# EAGLE design headstage-neuropix_no-test-fixtures (EAGLE 8.3.2)
DESIGNER: JON NEWMAN; DESIGN_NAME: HEADSTAGE-NEUROPIX; LICENSE: CERN OHL v1.2; REVISION: 1.2
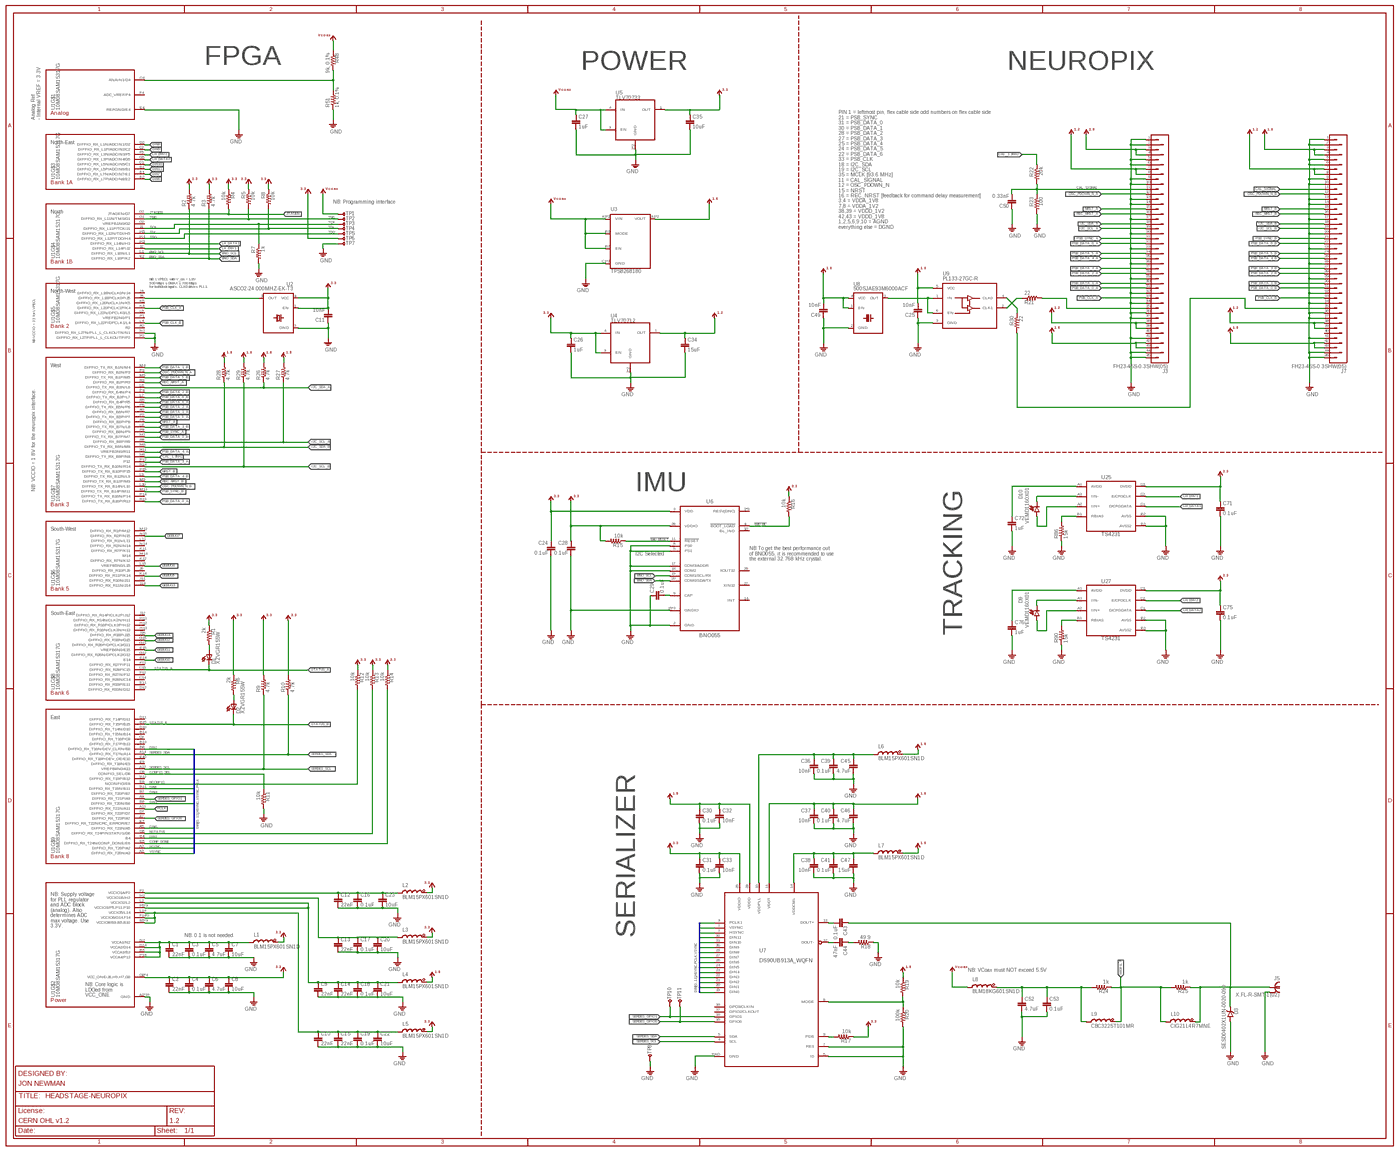
[diagram p0: schematic, sheet 1, overview]
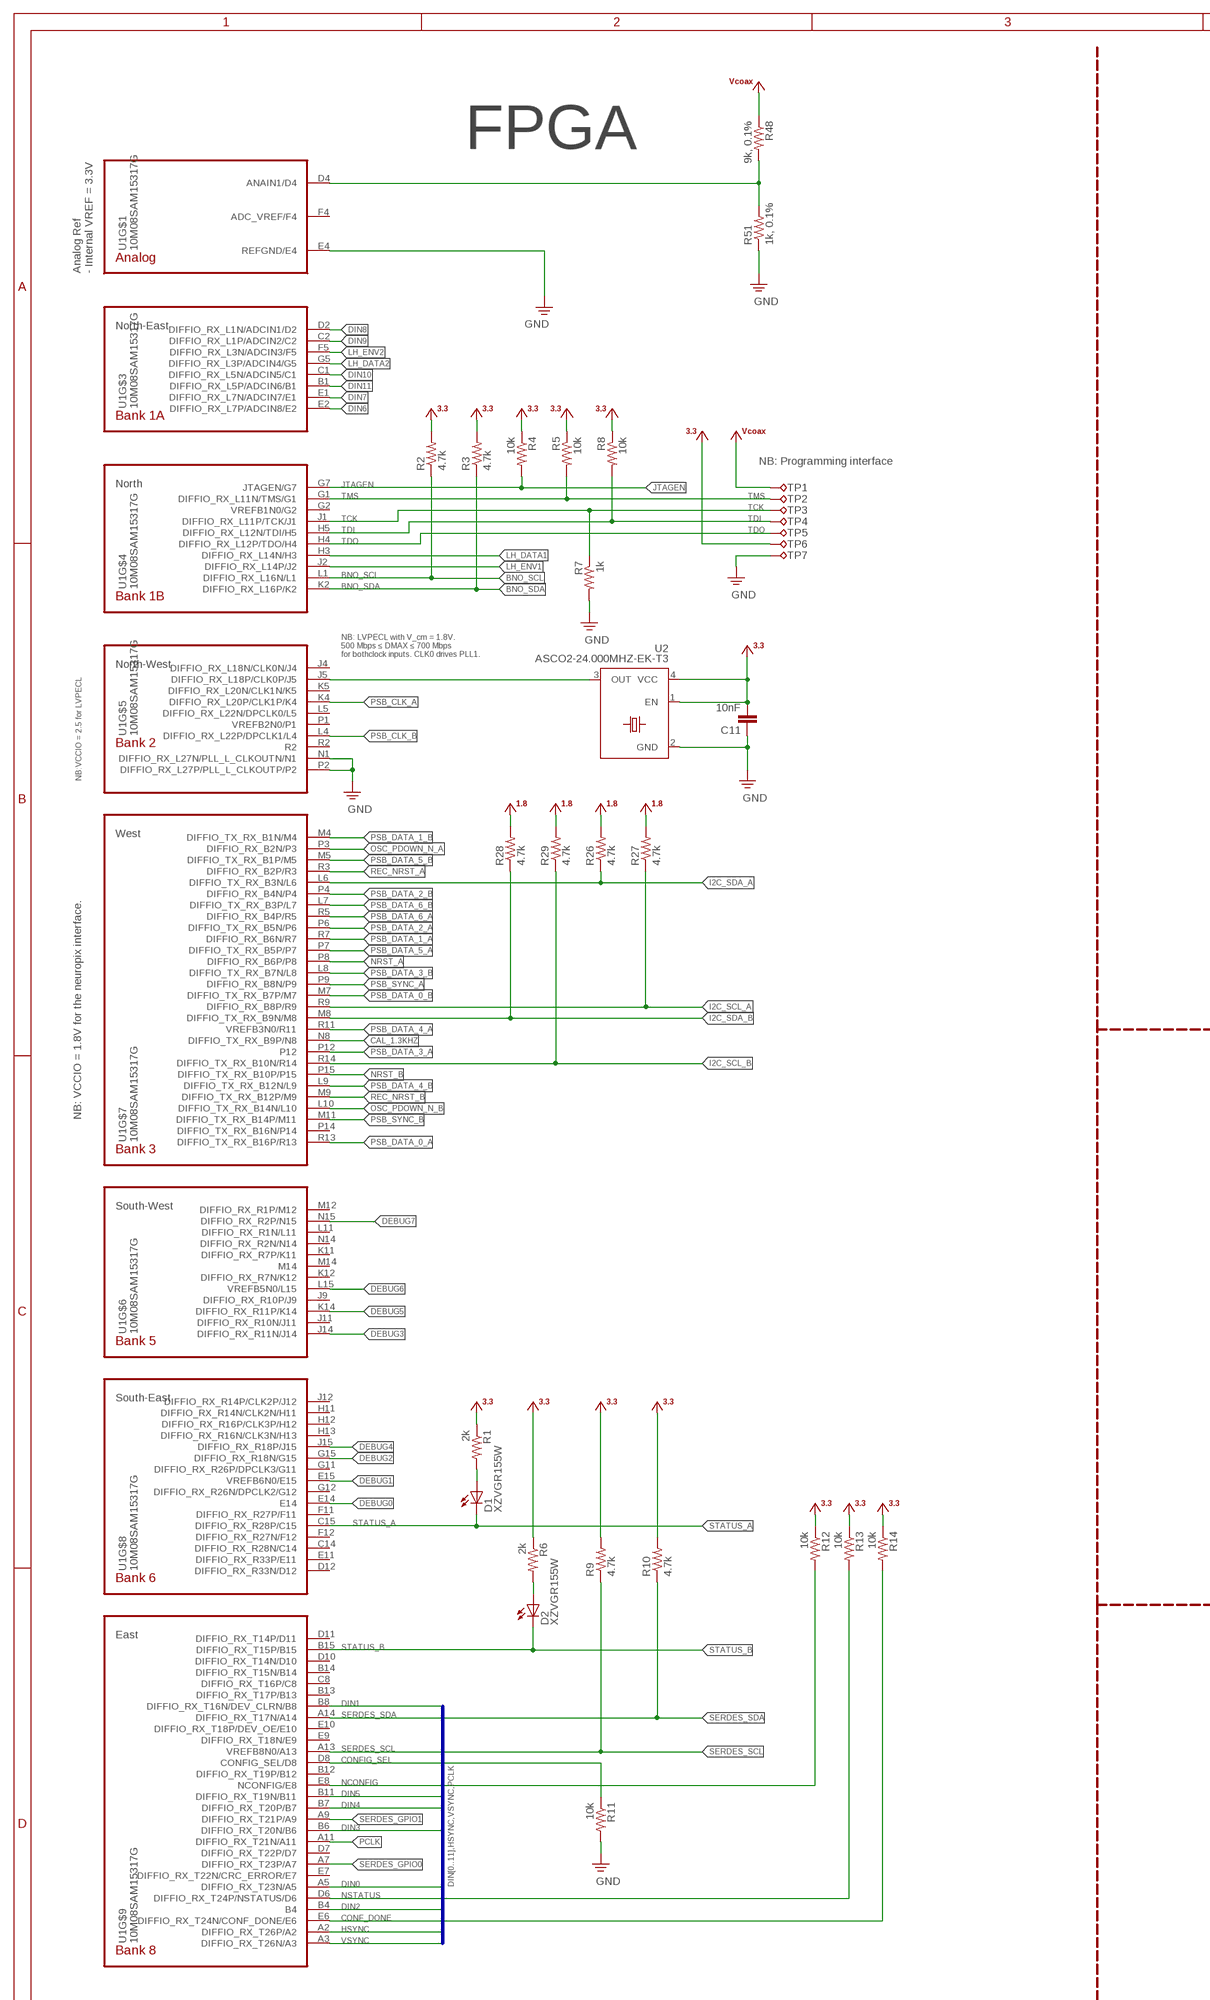
[diagram p1: schematic, sheet 1, part 1 of 4]
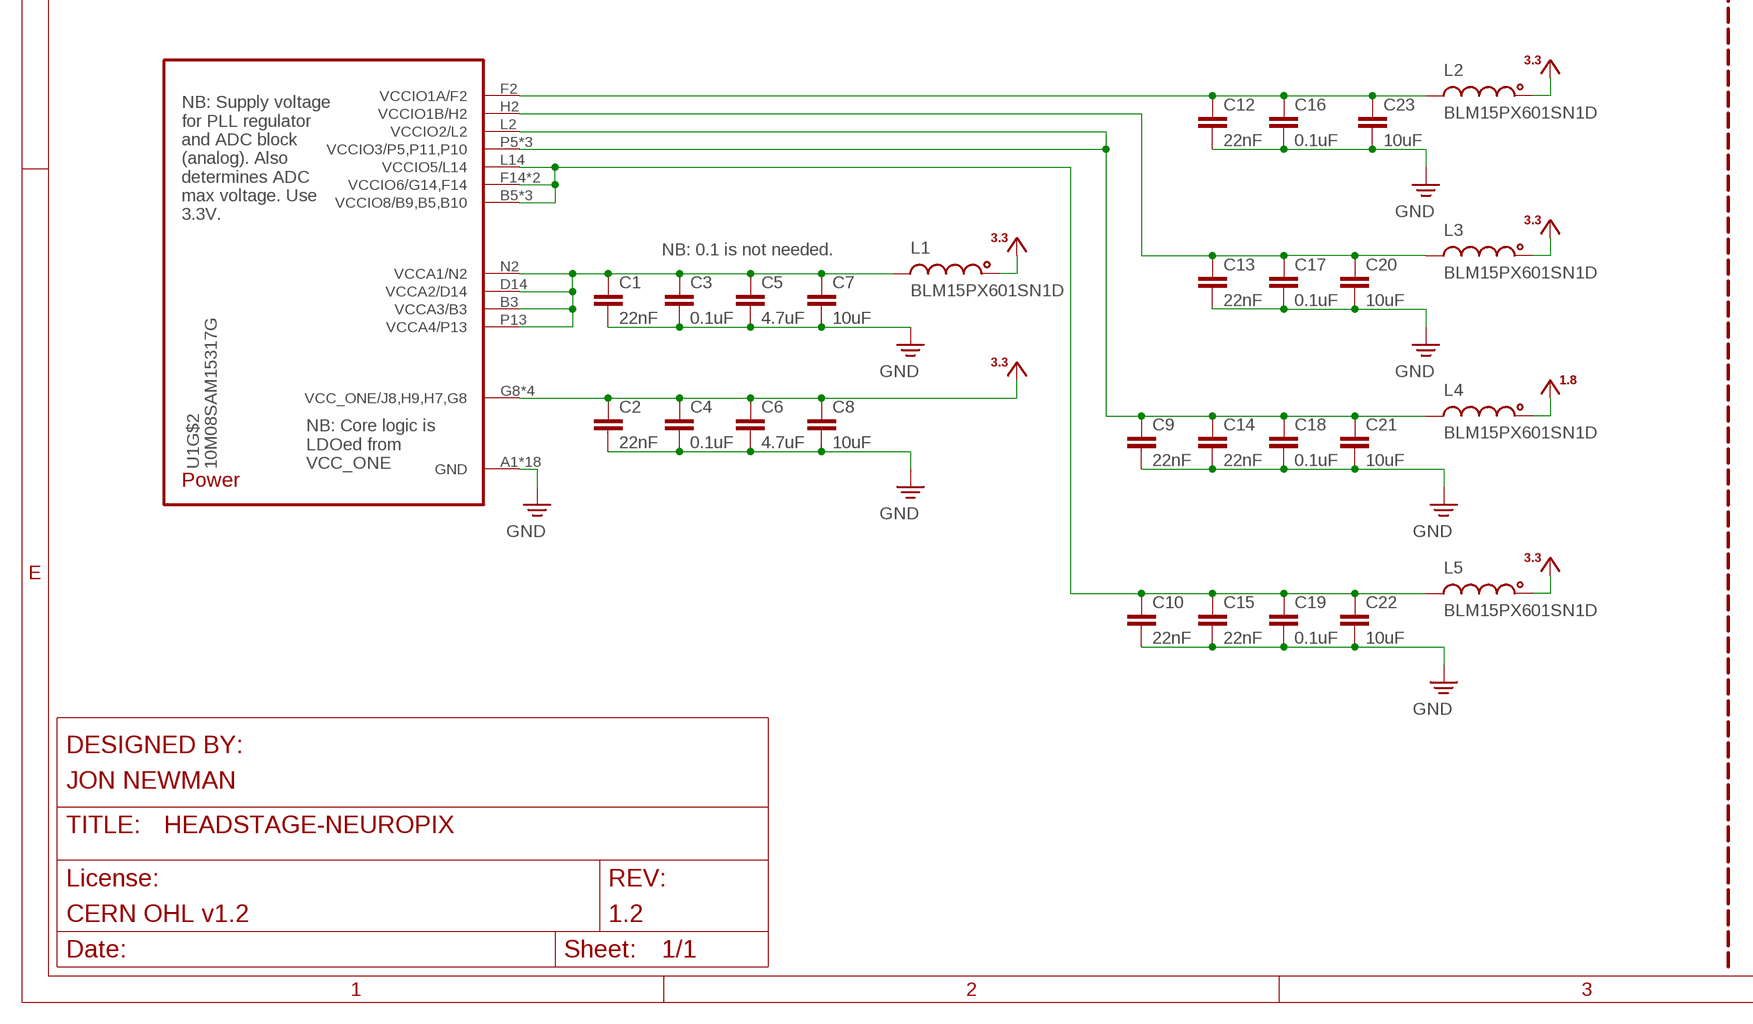
[diagram p2: schematic, sheet 1, part 2 of 4]
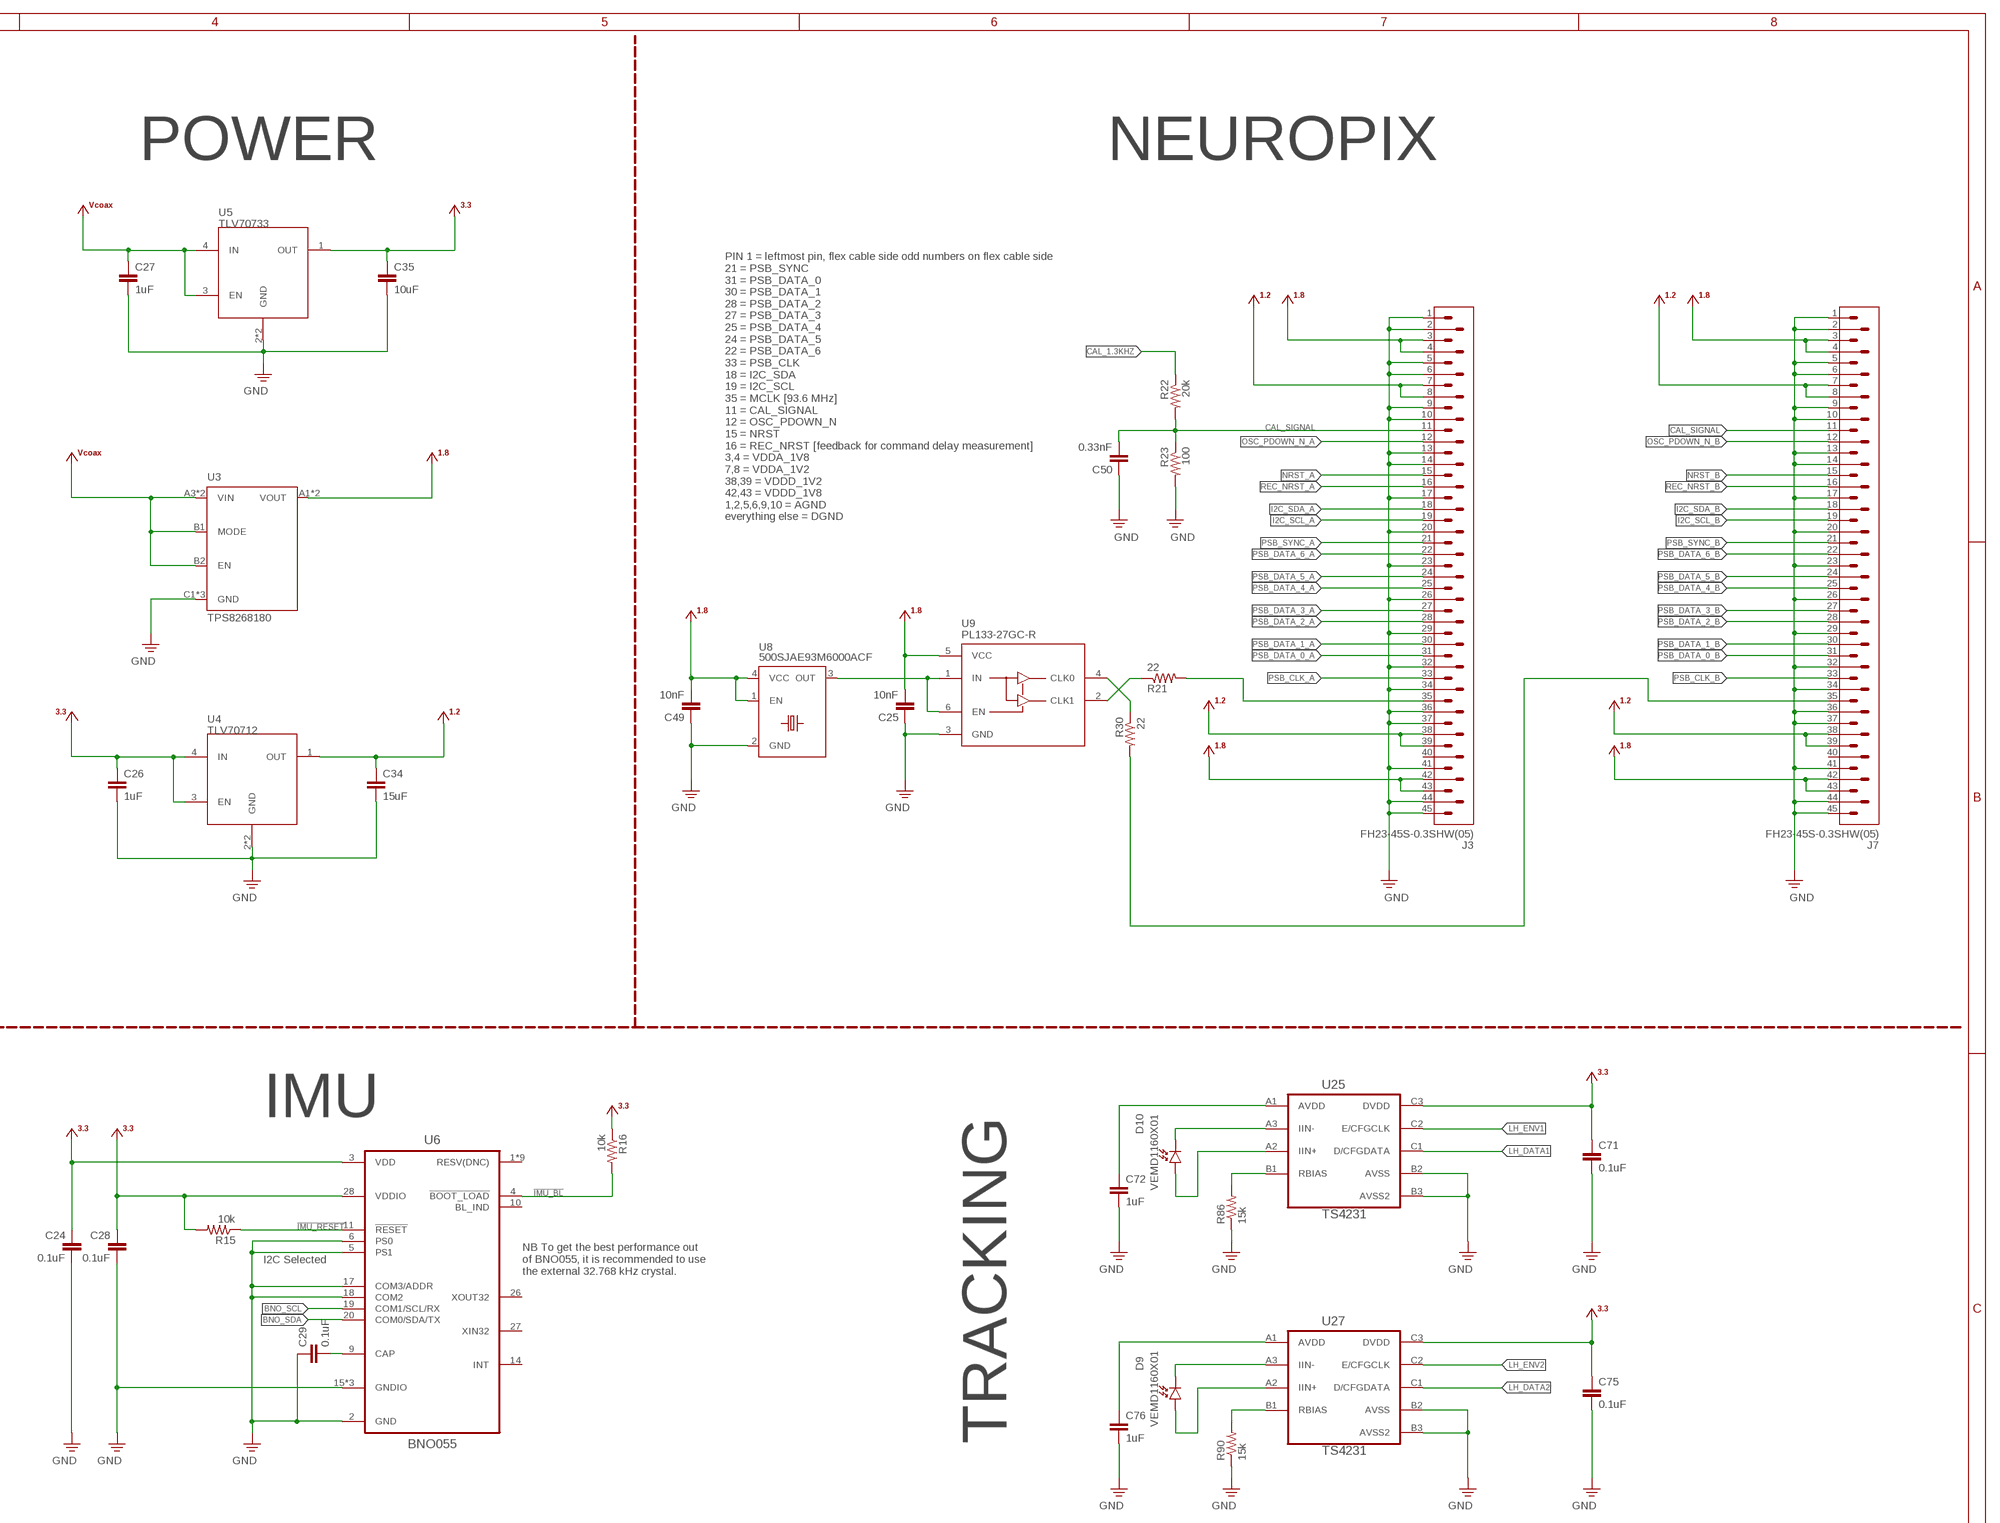
[diagram p3: schematic, sheet 1, part 3 of 4]
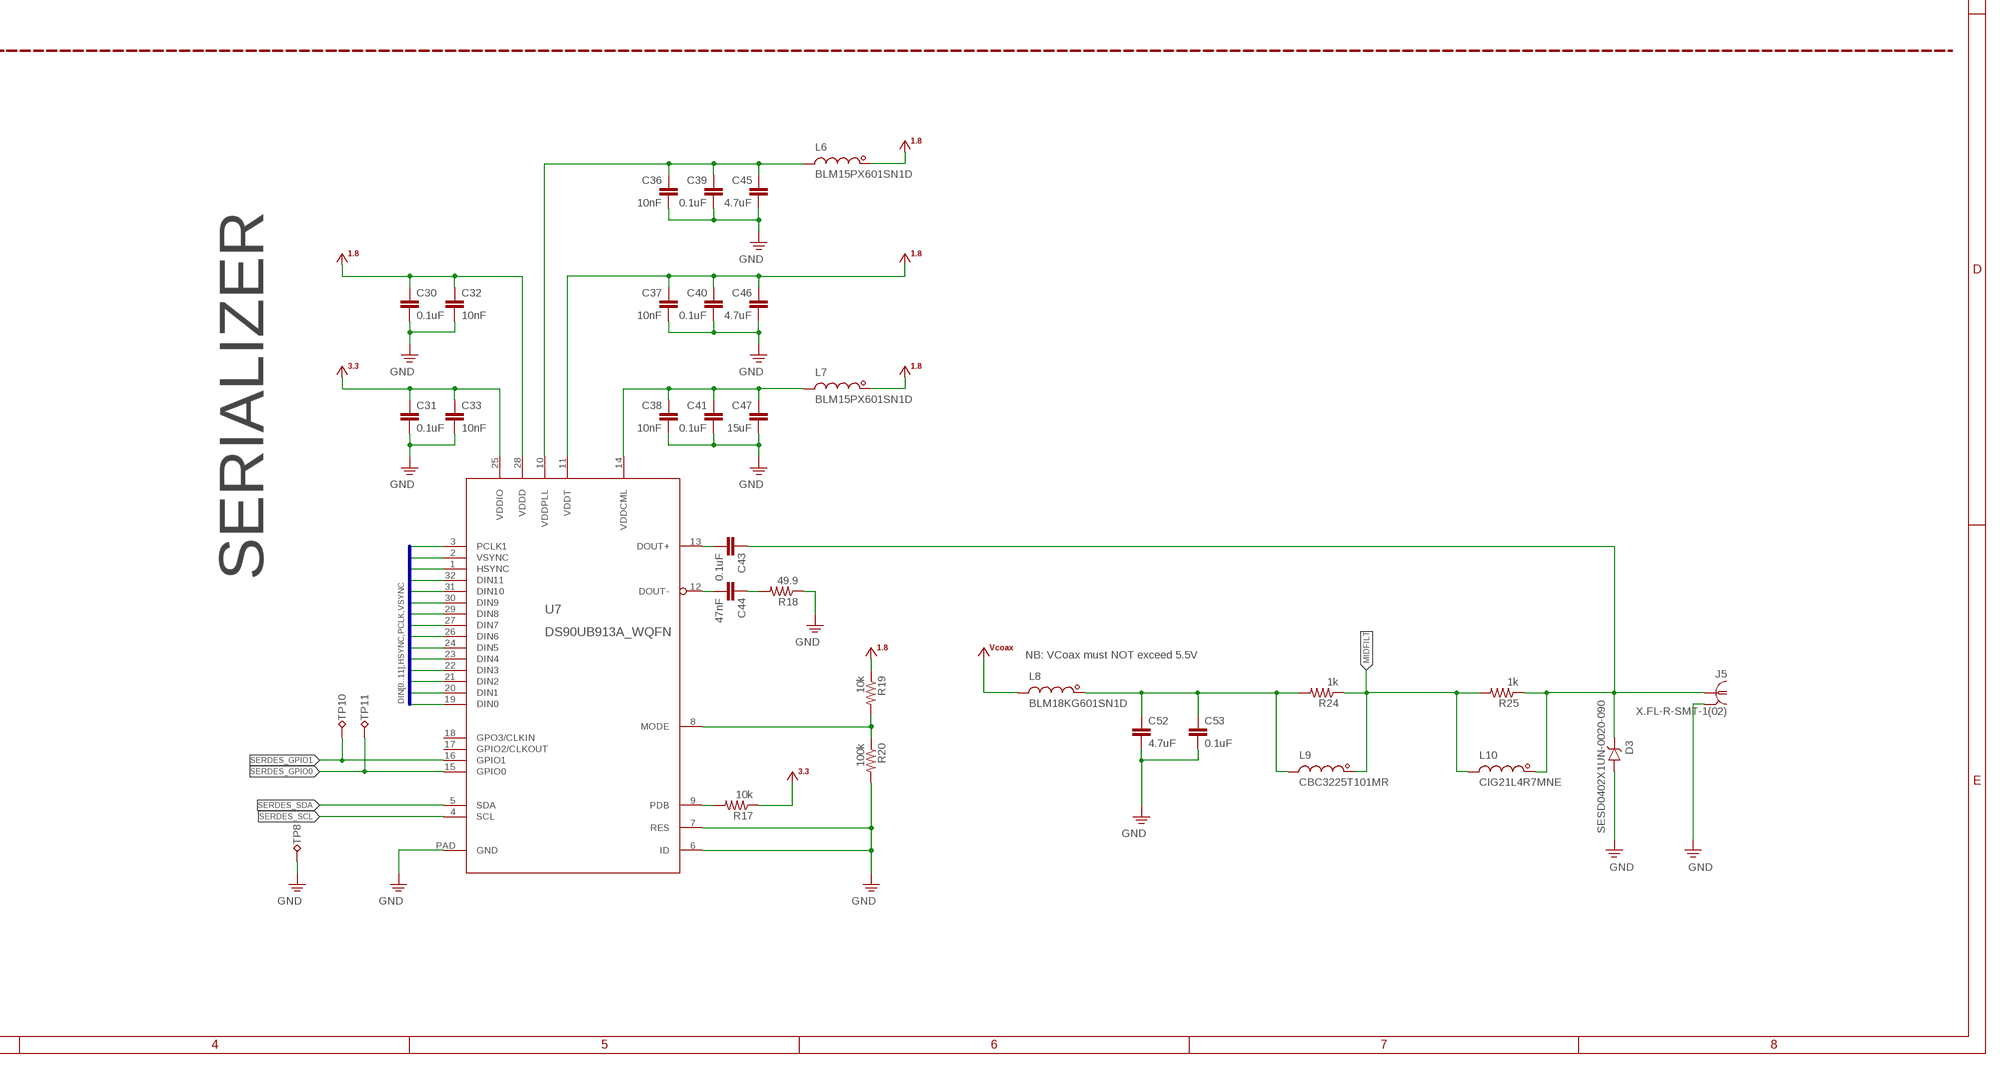
[diagram p4: schematic, sheet 1, part 4 of 4]

## Parts
C1  22nF  C_0201T  [0201T]
C2  22nF  C_0201T  [0201T]
C3  0.1uF  C_0201T  [0201T]
C4  0.1uF  C_0201T  [0201T]
C5  4.7uF  C_0402T  [0402T]
C6  4.7uF  C_0402T  [0402T]
C7  10uF  C_0402T  [0402T]
C8  10uF  C_0402T  [0402T]
C9  22nF  C_0201T  [0201T]
C10  22nF  C_0201T  [0201T]
C11  10nF  C_0201T  [0201T]
C12  22nF  C_0201T  [0201T]
C13  22nF  C_0201T  [0201T]
C14  22nF  C_0201T  [0201T]
C15  22nF  C_0201T  [0201T]
C16  0.1uF  C_0201T  [0201T]
C17  0.1uF  C_0201T  [0201T]
C18  0.1uF  C_0201T  [0201T]
C19  0.1uF  C_0201T  [0201T]
C20  10uF  C_0402T  [0402T]
C21  10uF  C_0402T  [0402T]
C22  10uF  C_0402T  [0402T]
C23  10uF  C_0402T  [0402T]
C24  0.1uF  C_0201T  [0201T]
C25  10nF  C_0201T  [0201T]
C26  1uF  C_0402T  [0402T]
C27  1uF  C_0402T  [0402T]
C28  0.1uF  C_0201T  [0201T]
C29  0.1uF  C_0201T  [0201T]
C30  0.1uF  C_0201T  [0201T]
C31  0.1uF  C_0201T  [0201T]
C32  10nF  C_0201T  [0201T]
C33  10nF  C_0201T  [0201T]
C34  15uF  C_0402TW  [0402TW]
C35  10uF  C_0402T  [0402T]
C36  10nF  C_0201T  [0201T]
C37  10nF  C_0201T  [0201T]
C38  10nF  C_0201T  [0201T]
C39  0.1uF  C_0201T  [0201T]
C40  0.1uF  C_0201T  [0201T]
C41  0.1uF  C_0201T  [0201T]
C43  0.1uF  C_0201T  [0201T]
C44  47nF  C_0201T  [0201T]
C45  4.7uF  C_0402T  [0402T]
C46  4.7uF  C_0402T  [0402T]
C47  15uF  C_0402TW  [0402TW]
C49  10nF  C_0201T  [0201T]
C50  0.33nF  C_0201T  [0201T]
C52  4.7uF  C_0402T  [0402T]
C53  0.1uF  C_0201T  [0201T]
C71  0.1uF  C_0201T  [0201T]
C72  1uF  C_0201T  [0201T]
C75  0.1uF  C_0201T  [0201T]
C76  1uF  C_0201T  [0201T]
D1  XZVGR155W  LED_0201T  [LED-0201T]
D2  XZVGR155W  LED_0201T  [LED-0201T]
D3  SESD0402X1UN-0020-090  Z-DIODE_0402T-DFN  [0402T-DFN]
D9  VEMD1160X01  PHOTODIODE_0805PT  [0805PT]
D10  VEMD1160X01  PHOTODIODE_0805PT  [0805PT]
J3  FH23-45S-0.3SHW(05)  PINHD-1X45_FH23  [FH23-45S-0.3SHW(05)]
J5  X.FL-R-SMT-1(02)  COAX_XFL  [X_FL_R_SMT_1(02)]
J7  FH23-45S-0.3SHW(05)  PINHD-1X45_FH23  [FH23-45S-0.3SHW(05)]
L1  BLM15PX601SN1D  L_0402T  [0402T]
L2  BLM15PX601SN1D  L_0402T  [0402T]
L3  BLM15PX601SN1D  L_0402T  [0402T]
L4  BLM15PX601SN1D  L_0402T  [0402T]
L5  BLM15PX601SN1D  L_0402T  [0402T]
L6  BLM15PX601SN1D  L_0402T  [0402T]
L7  BLM15PX601SN1D  L_0402T  [0402T]
L8  BLM18KG601SN1D  L_0603T  [0603T]
L9  CBC3225T101MR  L_1210T  [1210T]
L10  CIG21L4R7MNE  L_0805T  [0805T]
R1  2k  R_0201T  [0201T]
R2  4.7k  R_0201T  [0201T]
R3  4.7k  R_0201T  [0201T]
R4  10k  R_0201T  [0201T]
R5  10k  R_0201T  [0201T]
R6  2k  R_0201T  [0201T]
R7  1k  R_0201T  [0201T]
R8  10k  R_0201T  [0201T]
R9  4.7k  R_0201T  [0201T]
R10  4.7k  R_0201T  [0201T]
R11  10k  R_0201T  [0201T]
R12  10k  R_0201T  [0201T]
R13  10k  R_0201T  [0201T]
R14  10k  R_0201T  [0201T]
R15  10k  R_0201T  [0201T]
R16  10k  R_0201T  [0201T]
R17  10k  R_0201T  [0201T]
R18  49.9  R_0201T  [0201T]
R19  10k  R_0201T  [0201T]
R20  100k  R_0201T  [0201T]
R21  22  R_0201T  [0201T]
R22  20k  R_0201T  [0201T]
R23  100  R_0201T  [0201T]
R24  1k  R_0201T  [0201T]
R25  1k  R_0201T  [0201T]
R26  4.7k  R_0201T  [0201T]
R27  4.7k  R_0201T  [0201T]
R28  4.7k  R_0201T  [0201T]
R29  4.7k  R_0201T  [0201T]
R30  22  R_0201T  [0201T]
R48  9k, 0.1%  R_0201T  [0201T]
R51  1k, 0.1%  R_0201T  [0201T]
R86  15k  R_0201T  [0201T]
R90  15k  R_0201T  [0201T]
TP1  TPTP10R  [TP10R]
TP2  TPTP10R  [TP10R]
TP3  TPTP10R  [TP10R]
TP4  TPTP10R  [TP10R]
TP5  TPTP10R  [TP10R]
TP6  TPTP10R  [TP10R]
TP7  TPTP10R  [TP10R]
TP8  TPTP11R  [TP11R]
TP10  TPTP09R  [TP09R]
TP11  TPTP09R  [TP09R]
U1  10M08SAM15317G  10M08SAM153_MBGA  [MBGA153-8X8]
U2  ASCO2-24.000MHZ-EK-T3  CRYSTAL-OSC_ASCO  [ASCO]
U3  TPS8268180  TPS8268X  [MICROSIP9-3X2.3]
U4  TLV70712  TLV707  [X2SON]
U5  TLV70733  TLV707  [X2SON]
U6  BNO055  [LGA-28-3.8X5.2]
U7  DS90UB913A_WQFN  [WQFN32-5X5]
U8  500SJAE93M6000ACF  CRYSTAL-OSC_SIT8008BCA7-18E  [SIT8008BCA7-18E]
U9  PL133-27GC-R  CLKBUF2_DFN_2X1.3_PAD  [DFN6_2X1.3_PAD]
U25  TS4231  [WLCSP3X3]
U27  TS4231  [WLCSP3X3]

## Nets
24MHZ_P: U1.J5(DIFFIO_RX_L18P/CLK0P/J5) U2.3(OUT)
!IMU_BL: R16.2 U6.4(!BOOT_LOAD)
!IMU_RESET: R15.1 U6.11(!RESET)
+1V2: C34.1 J3.7 J3.8 J3.38 J3.39 J7.7 J7.8 J7.38 J7.39 U4.1(OUT)
+1V8: C25.2 C30.1 C32.1 C37.1 C40.1 C46.1 C49.2 J3.3 J3.4 J3.42 J3.43 J7.3 J7.4 J7.42 J7.43 L4.1 L6.1 L7.1 R19.1 R26.2 R27.2 R28.2 R29.2 U3.A1(VOUT) U3.A2(VOUT) U7.11(VDDT) U7.28(VDDD) U8.1(EN) U8.4(VCC) U9.5(VCC)
+3V3: C2.1 C4.1 C6.1 C8.1 C11.2 C24.1 C26.1 C28.1 C31.1 C33.1 C35.1 C71.1 C75.1 L1.1 L2.1 L3.1 L5.1 R1.1 R2.2 R3.2 R4.1 R5.1 R6.1 R8.1 R9.2 R10.2 R12.1 R13.1 R14.1 R15.2 R16.1 R17.1 TP6.TP U1.G8(VCC_ONE/J8,H9,H7,G8) U1.H7(VCC_ONE/J8,H9,H7,G8) U1.H9(VCC_ONE/J8,H9,H7,G8) U1.J8(VCC_ONE/J8,H9,H7,G8) U2.1(EN) U2.4(VCC) U4.3(EN) U4.4(IN) U5.1(OUT) U6.3(VDD) U6.28(VDDIO) U7.25(VDDIO) U25.C3(DVDD) U27.C3(DVDD)
BNO_SCL: R2.1 U1.L1(DIFFIO_RX_L16N/L1) U6.19(COM1/SCL/RX)
BNO_SDA: R3.1 U1.K2(DIFFIO_RX_L16P/K2) U6.20(COM0/SDA/TX)
CAL_1.3KHZ: R22.1 U1.N8(DIFFIO_TX_RX_B9P/N8)
CAL_SIGNAL: C50.2 J3.11 J7.11 R22.2 R23.1
CONF_DONE: R14.2 U1.E6(DIFFIO_RX_T24N/CONF_DONE/E6)
CONFIG_SEL: R11.1 U1.D8(CONFIG_SEL/D8)
DEBUG0: U1.E14
DEBUG1: U1.E15(VREFB6N0/E15)
DEBUG2: U1.G15(DIFFIO_RX_R18N/G15)
DEBUG3: U1.J14(DIFFIO_RX_R11N/J14)
DEBUG4: U1.J15(DIFFIO_RX_R18P/J15)
DEBUG5: U1.K14(DIFFIO_RX_R11P/K14)
DEBUG6: U1.L15(VREFB5N0/L15)
DEBUG7: U1.N15(DIFFIO_RX_R2P/N15)
DIN0: U1.A5(DIFFIO_RX_T23N/A5) U7.19(DIN0)
DIN1: U1.B8(DIFFIO_RX_T16N/DEV_CLRN/B8) U7.20(DIN1)
DIN2: U1.B4 U7.21(DIN2)
DIN3: U1.B6(DIFFIO_RX_T20N/B6) U7.22(DIN3)
DIN4: U1.B7(DIFFIO_RX_T20P/B7) U7.23(DIN4)
DIN5: U1.B11(DIFFIO_RX_T19N/B11) U7.24(DIN5)
DIN6: U1.E2(DIFFIO_RX_L7P/ADCIN8/E2) U7.26(DIN6)
DIN7: U1.E1(DIFFIO_RX_L7N/ADCIN7/E1) U7.27(DIN7)
DIN8: U1.D2(DIFFIO_RX_L1N/ADCIN1/D2) U7.29(DIN8)
DIN9: U1.C2(DIFFIO_RX_L1P/ADCIN2/C2) U7.30(DIN9)
DIN10: U1.C1(DIFFIO_RX_L5N/ADCIN5/C1) U7.31(DIN10)
DIN11: U1.B1(DIFFIO_RX_L5P/ADCIN6/B1) U7.32(DIN11)
GND: C1.2 C2.2 C3.2 C4.2 C5.2 C6.2 C7.2 C8.2 C9.2 C10.2 C11.1 C12.2 C13.2 C14.2 C15.2 C16.2 C17.2 C18.2 C19.2 C20.2 C21.2 C22.2 C23.2 C24.2 C25.1 C26.2 C27.2 C28.2 C29.1 C30.2 C31.2 C32.2 C33.2 C34.2 C35.2 C36.2 C37.2 C38.2 C39.2 C40.2 C41.2 C45.2 C46.2 C47.2 C49.1 C50.1 C52.2 C53.2 C71.2 C72.2 C75.2 C76.2 D3.A J3.1 J3.2 J3.5 J3.6 J3.9 J3.10 J3.13 J3.14 J3.17 J3.20 J3.23 J3.26 J3.29 J3.32 J3.34 J3.36 J3.37 J3.41 J3.44 J3.45 J5.P$2 J5.P$3 J5.P$4 J7.1 J7.2 J7.5 J7.6 J7.9 J7.10 J7.13 J7.14 J7.17 J7.20 J7.23 J7.26 J7.29 J7.32 J7.34 J7.36 J7.37 J7.41 J7.44 J7.45 R7.2 R11.2 R18.1 R20.2 R23.2 R51.1 R86.1 R90.1 TP7.TP TP8.TP U1.A1(GND) U1.A15(GND) U1.B2(GND) U1.D5(GND) U1.D9(GND) U1.E4(REFGND/E4) U1.E5(GND) U1.E12(GND) U1.G4(GND) U1.G9(GND) U1.H8(GND) U1.H14(GND) U1.J7(GND) U1.L12(GND) U1.M2(GND) U1.M6(GND) U1.M10(GND) U1.N1(DIFFIO_RX_L27N/PLL_L_CLKOUTN/N1) U1.P2(DIFFIO_RX_L27P/PLL_L_CLKOUTP/P2) U1.R1(GND) U1.R15(GND) U2.2(GND) U3.C1(GND) U3.C2(GND) U3.C3(GND) U4.2(GND) U4.PAD(GND) U5.2(GND) U5.PAD(GND) U6.2(GND) U6.5(PS1) U6.6(PS0) U6.15(GNDIO) U6.16(GNDIO) U6.17(COM3/ADDR) U6.18(COM2) U6.25(GNDIO) U7.6(ID) U7.7(RES) U7.PAD(GND) U8.2(GND) U9.3(GND) U25.B2(AVSS) U25.B3(AVSS2) U27.B2(AVSS) U27.B3(AVSS2)
HSYNC: U1.A2(DIFFIO_RX_T26P/A2) U7.1(HSYNC)
I2C_SCL_A: J3.19 R27.1 U1.R9(DIFFIO_RX_B8P/R9)
I2C_SCL_B: J7.19 R29.1 U1.R14(DIFFIO_TX_RX_B10N/R14)
I2C_SDA_A: J3.18 R26.1 U1.L6(DIFFIO_TX_RX_B3N/L6)
I2C_SDA_B: J7.18 R28.1 U1.M8(DIFFIO_TX_RX_B9N/M8)
JTAGEN: R4.2 U1.G7(JTAGEN/G7)
LH_DATA1: U1.H3(DIFFIO_RX_L14N/H3) U25.C1(D/CFGDATA)
LH_DATA2: U1.G5(DIFFIO_RX_L3P/ADCIN4/G5) U27.C1(D/CFGDATA)
LH_ENV1: U1.J2(DIFFIO_RX_L14P/J2) U25.C2(E/CFGCLK)
LH_ENV2: U1.F5(DIFFIO_RX_L3N/ADCIN3/F5) U27.C2(E/CFGCLK)
MIDFILT: L9.1 L10.2 R24.1 R25.2
N$1: U8.3(OUT) U9.1(IN) U9.6(EN)
N$2: R30.1 U9.4(CLK0)
N$3: J3.35 R21.2
N$4: C13.1 C17.1 C20.1 L3.2 U1.H2(VCCIO1B/H2)
N$5: J7.35 R30.2
N$6: R21.1 U9.2(CLK1)
N$7: D10.C U25.A3(IIN-)
N$8: D10.A U25.A2(IIN+)
N$9: R86.2 U25.B1(RBIAS)
N$12: C72.1 U25.A1(AVDD)
N$13: C52.1 C53.1 L8.1 L9.2 R24.2
N$14: D9.C U27.A3(IIN-)
N$15: D9.A U27.A2(IIN+)
N$16: R90.2 U27.B1(RBIAS)
N$28: C43.2 U7.13(DOUT+)
N$30: R17.2 U7.9(PDB)
N$31: C44.2 U7.12(DOUT-)
N$32: C44.1 R18.2
N$33: R19.2 R20.1 U7.8(MODE)
N$34: C36.1 C39.1 C45.1 L6.2 U7.10(VDDPLL)
N$35: C38.1 C41.1 C47.1 L7.2 U7.14(VDDCML)
N$36: C76.1 U27.A1(AVDD)
N$52: R48.2 R51.2 U1.D4(ANAIN1/D4)
N$67: C29.2 U6.9(CAP)
N$92: D2.2(A) R6.2
N$93: D1.2(A) R1.2
NCONFIG: R12.2 U1.E8(NCONFIG/E8)
NRST_A: J3.15 U1.P8(DIFFIO_RX_B6P/P8)
NRST_B: J7.15 U1.P15(DIFFIO_TX_RX_B10P/P15)
NSTATUS: R13.2 U1.D6(DIFFIO_RX_T24P/NSTATUS/D6)
OSC_PDOWN_N_A: J3.12 U1.P3(DIFFIO_RX_B2N/P3)
OSC_PDOWN_N_B: J7.12 U1.L10(DIFFIO_TX_RX_B14N/L10)
PCLK: U1.A11(DIFFIO_RX_T21N/A11) U7.3(PCLK1)
PSB_CLK_A: J3.33 U1.K4(DIFFIO_RX_L20P/CLK1P/K4)
PSB_CLK_B: J7.33 U1.L4(DIFFIO_RX_L22P/DPCLK1/L4)
PSB_DATA_0_A: J3.31 U1.R13(DIFFIO_TX_RX_B16P/R13)
PSB_DATA_0_B: J7.31 U1.M7(DIFFIO_TX_RX_B7P/M7)
PSB_DATA_1_A: J3.30 U1.R7(DIFFIO_RX_B6N/R7)
PSB_DATA_1_B: J7.30 U1.M4(DIFFIO_TX_RX_B1N/M4)
PSB_DATA_2_A: J3.28 U1.P6(DIFFIO_TX_RX_B5N/P6)
PSB_DATA_2_B: J7.28 U1.P4(DIFFIO_RX_B4N/P4)
PSB_DATA_3_A: J3.27 U1.P12
PSB_DATA_3_B: J7.27 U1.L8(DIFFIO_TX_RX_B7N/L8)
PSB_DATA_4_A: J3.25 U1.R11(VREFB3N0/R11)
PSB_DATA_4_B: J7.25 U1.L9(DIFFIO_TX_RX_B12N/L9)
PSB_DATA_5_A: J3.24 U1.P7(DIFFIO_TX_RX_B5P/P7)
PSB_DATA_5_B: J7.24 U1.M5(DIFFIO_TX_RX_B1P/M5)
PSB_DATA_6_A: J3.22 U1.R5(DIFFIO_RX_B4P/R5)
PSB_DATA_6_B: J7.22 U1.L7(DIFFIO_TX_RX_B3P/L7)
PSB_SYNC_A: J3.21 U1.P9(DIFFIO_RX_B8N/P9)
PSB_SYNC_B: J7.21 U1.M11(DIFFIO_TX_RX_B14P/M11)
REC_NRST_A: J3.16 U1.R3(DIFFIO_RX_B2P/R3)
REC_NRST_B: J7.16 U1.M9(DIFFIO_TX_RX_B12P/M9)
SERDES_GPIO0: TP11.TP U1.A7(DIFFIO_RX_T23P/A7) U7.15(GPIO0)
SERDES_GPIO1: TP10.TP U1.A9(DIFFIO_RX_T21P/A9) U7.16(GPIO1)
SERDES_SCL: R9.1 U1.A13(VREFB8N0/A13) U7.4(SCL)
SERDES_SDA: R10.1 U1.A14(DIFFIO_RX_T17N/A14) U7.5(SDA)
SIGOUT: C43.1 D3.C J5.P$1 L10.1 R25.1
STATUS_A: D1.1(C) U1.C15(DIFFIO_RX_R28P/C15)
STATUS_B: D2.1(C) U1.B15(DIFFIO_RX_T15P/B15)
TCK: R7.1 TP3.TP U1.J1(DIFFIO_RX_L11P/TCK/J1)
TDI: R8.2 TP4.TP U1.H5(DIFFIO_RX_L12N/TDI/H5)
TDO: TP5.TP U1.H4(DIFFIO_RX_L12P/TDO/H4)
TMS: R5.2 TP2.TP U1.G1(DIFFIO_RX_L11N/TMS/G1)
VCCA: C1.1 C3.1 C5.1 C7.1 L1.2 U1.B3(VCCA3/B3) U1.D14(VCCA2/D14) U1.N2(VCCA1/N2) U1.P13(VCCA4/P13)
VCCIO: C10.1 C15.1 C19.1 C22.1 L5.2 U1.B5(VCCIO8/B9,B5,B10) U1.B9(VCCIO8/B9,B5,B10) U1.B10(VCCIO8/B9,B5,B10) U1.F14(VCCIO6/G14,F14) U1.G14(VCCIO6/G14,F14) U1.L14(VCCIO5/L14)
VCCIO2: C9.1 C14.1 C18.1 C21.1 L4.2 U1.L2(VCCIO2/L2) U1.P5(VCCIO3/P5,P11,P10) U1.P10(VCCIO3/P5,P11,P10) U1.P11(VCCIO3/P5,P11,P10)
VCCIOA: C12.1 C16.1 C23.1 L2.2 U1.F2(VCCIO1A/F2)
VCOAX: C27.1 L8.2 R48.1 TP1.TP U3.A3(VIN) U3.B1(MODE) U3.B2(EN) U3.B3(VIN) U5.3(EN) U5.4(IN) ; supply symbol labelled +VCOAX
VSYNC: U1.A3(DIFFIO_RX_T26N/A3) U7.2(VSYNC)
Unconnected: J3.40 J7.40 U1.B12(DIFFIO_RX_T19P/B12) U1.B13(DIFFIO_RX_T17P/B13) U1.B14(DIFFIO_RX_T15N/B14) U1.C8(DIFFIO_RX_T16P/C8) U1.C14(DIFFIO_RX_R28N/C14) U1.D7(DIFFIO_RX_T22P/D7) U1.D10(DIFFIO_RX_T14N/D10) U1.D11(DIFFIO_RX_T14P/D11) U1.D12(DIFFIO_RX_R33N/D12) U1.E7(DIFFIO_RX_T22N/CRC_ERROR/E7) U1.E9(DIFFIO_RX_T18N/E9) U1.E10(DIFFIO_RX_T18P/DEV_OE/E10) U1.E11(DIFFIO_RX_R33P/E11) U1.F4(ADC_VREF/F4) U1.F11(DIFFIO_RX_R27P/F11) U1.F12(DIFFIO_RX_R27N/F12) U1.G2(VREFB1N0/G2) U1.G11(DIFFIO_RX_R26P/DPCLK3/G11) U1.G12(DIFFIO_RX_R26N/DPCLK2/G12) U1.H11(DIFFIO_RX_R14N/CLK2N/H11) U1.H12(DIFFIO_RX_R16P/CLK3P/H12) U1.H13(DIFFIO_RX_R16N/CLK3N/H13) U1.J4(DIFFIO_RX_L18N/CLK0N/J4) U1.J9(DIFFIO_RX_R10P/J9) U1.J11(DIFFIO_RX_R10N/J11) U1.J12(DIFFIO_RX_R14P/CLK2P/J12) U1.K5(DIFFIO_RX_L20N/CLK1N/K5) U1.K11(DIFFIO_RX_R7P/K11) U1.K12(DIFFIO_RX_R7N/K12) U1.L5(DIFFIO_RX_L22N/DPCLK0/L5) U1.L11(DIFFIO_RX_R1N/L11) U1.M12(DIFFIO_RX_R1P/M12) U1.M14 U1.N14(DIFFIO_RX_R2N/N14) U1.P1(VREFB2N0/P1) U1.P14(DIFFIO_TX_RX_B16N/P14) U1.R2 U6.1(RESV(DNC)) U6.7(RESV(DNC)) U6.8(RESV(DNC)) U6.10(BL_IND) U6.12(RESV(DNC)) U6.13(RESV(DNC)) U6.14(INT) U6.21(RESV(DNC)) U6.22(RESV(DNC)) U6.23(RESV(DNC)) U6.24(RESV(DNC)) U6.26(XOUT32) U6.27(XIN32) U7.17(GPIO2/CLKOUT) U7.18(GPO3/CLKIN)

## Buses
DIN[0..11],HSYNC,PCLK,VSYNC
DIN[0..11],HSYNC,VSYNC,PCLK

## Notes on the sheet
- FPGA | POWER | NEUROPIX
- Analog Ref
  - Internal VREF = 3.3V
- North-East
- NB: Programming interface
- North
- PIN 1 = leftmost pin, flex cable side odd numbers on flex cable side
  21 = PSB_SYNC 
  31 = PSB_DATA_0 
  30 = PSB_DATA_1 
  28 = PSB_DATA_2 
  27 = PSB_DATA_3 
  25 = PSB_DATA_4 
  24 = PSB_DATA_5 
  22 = PSB_DATA_6 
  33 = PSB_CLK
  18 = I2C_SDA 
  19 = I2C_SCL
  35 = MCLK [93.6 MHz]
  11 = CAL_SIGNAL 
  12 = OSC_PDOWN_N 
  15 = NRST 
  16 = REC_NRST [feedback for command delay measurement]
  3,4 = VDDA_1V8 
  7,8 = VDDA_1V2
  38,39 = VDDD_1V2 
  42,43 = VDDD_1V8
  1,2,5,6,9,10 = AGND 
  everything else = DGND
- NB: LVPECL with V_cm = 1.8V. 
  500 Mbps ≤ DMAX ≤ 700 Mbps 
  for bothclock inputs. CLK0 drives PLL1.
- North-West
- NB:VCCIO = 2.5 for LVPECL
- West
- NB: VCCIO = 1.8V for the neuropix interface. | IMU
- South-West
- I2C Selected
- NB To get the best performance out
  of BNO055, it is recommended to use
  the external 32.768 kHz crystal.
- South-East
- TRACKING
- East
- NB: Supply voltage 
  for PLL regulator 
  and ADC block 
  (analog). Also 
  determines ADC 
  max voltage. Use
  3.3V.
- NB: 0.1 is not needed. | SERIALIZER
- NB: VCoax must NOT exceed 5.5V
- NB: Core logic is 
  LDOed from 
  VCC_ONE

## Library data of the parts
C1-C41 C43-C47 C49 C50 C52 C53 = jonnew:C: Capacitor
C71 C75 = jonnew:C: Capacitor; PARTNO: C0603X5R1C104K030BC
C72 C76 = jonnew:C: Capacitor; PARTNO: CL03A105MP3ZSNH
D1 D2 = jonnew:LED: Surface mount LED
D3 = jonnew:Z-DIODE: Zener Diode
D9 D10 = jonnew:PHOTODIODE
J3 J7 = jonnew:PINHD-1X45
J5 = jonnew:COAX: COAX CONNECTOR - Edge mount BNC - Vertical BNC - Vertical SMA - etc
L1-L10 = jonnew:L: Inductor
R1-R30 R48 R51 R86 R90 = jonnew:R: Resistor
TP1-TP8 TP10 TP11 = jonnew:TP: Test pad
U1 = jonnew:10M08SAM153
U2 U8 = jonnew:CRYSTAL-OSC
U3 = jonnew:TPS8268X
U4 U5 = jonnew:TLV707
U6 = jonnew:BNO055
U7 = jonnew:DS90UB913A
U9 = jonnew:CLKBUF2
U25 U27 = jonnew:TS4231

## Net classes
1 diff: width 0.09 mm, drill 0.2 mm, clearance 0.09 mm

## Board
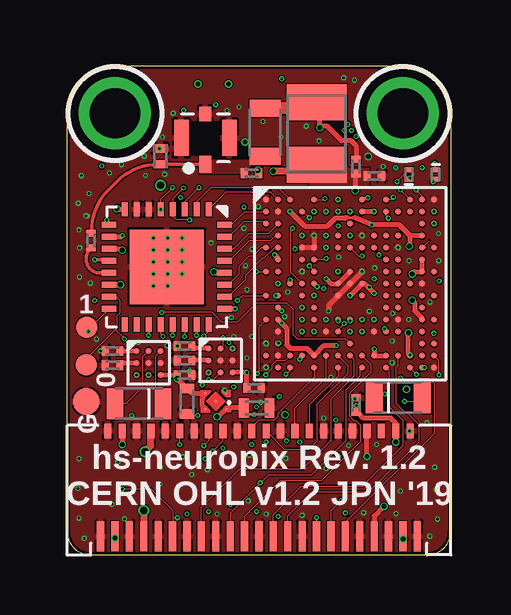
[diagram p5: board, top side]
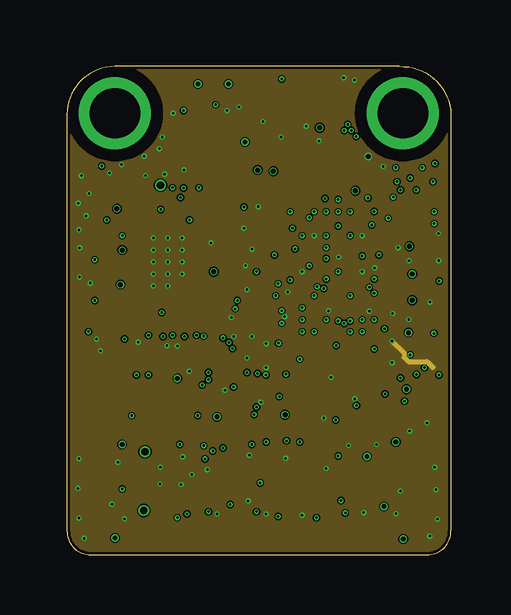
[diagram p6: board, inner layer GND1]
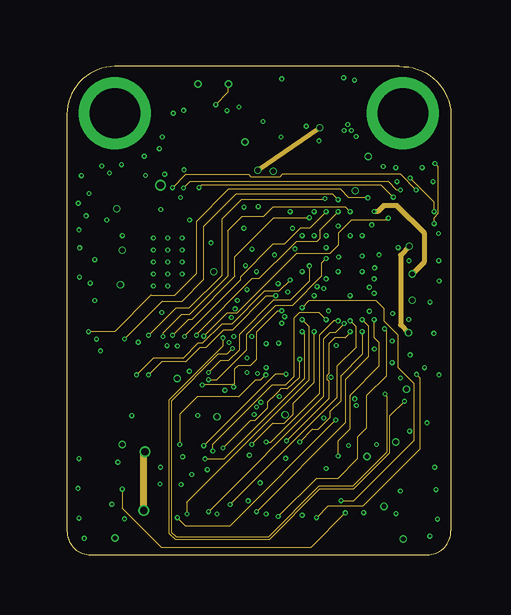
[diagram p7: board, inner layer Highspeed2]
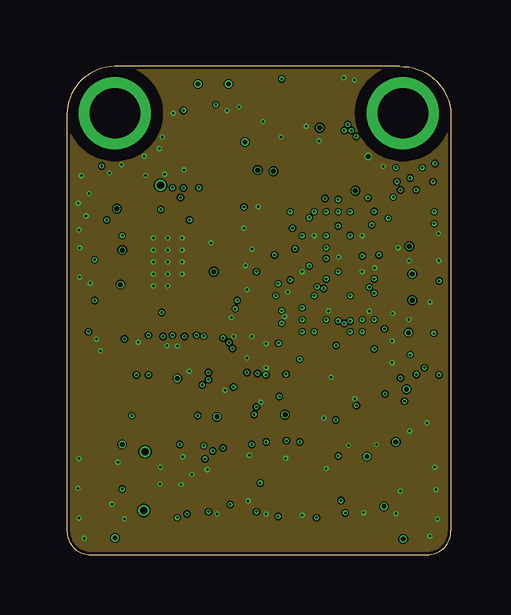
[diagram p8: board, inner layer GND2]
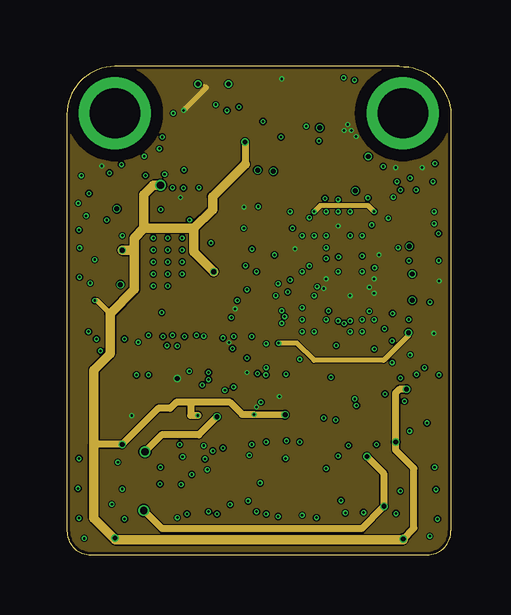
[diagram p9: board, inner layer VCC]
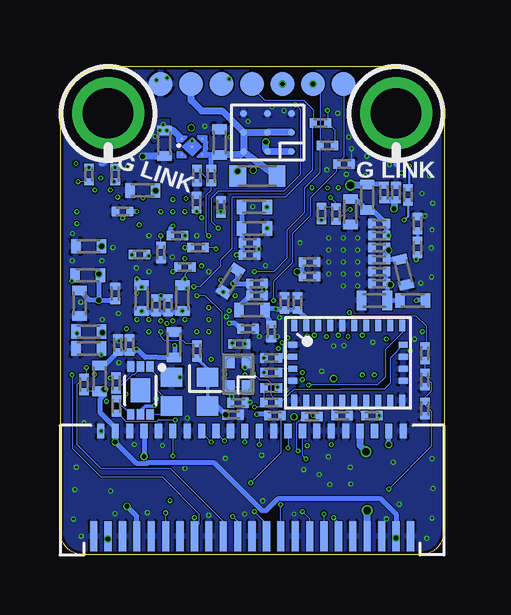
[diagram p10: board, bottom side, seen from below]

Size 16 x 20.35 mm. Coordinates in mm from the lower left corner, seen from the top.
Outline: 0,18.35 0,1 arc90 1,0 15,0 arc90 16,1 16,18.35 arc90 13.85,20.35 2,20.35 arc90 0,18.35
Copper layers (1*2*3+4*5*16): Highspeed1 0.036mm / dielectric 4mil / GND1 0.036mm / dielectric 5mil / Highspeed2 0.036mm / dielectric 0.10921875mm / GND2 0.036mm / dielectric 5mil / VCC 0.036mm / dielectric 4mil / LowSpeed 0.036mm
Design rules "headstage-neuropix *": minimum track width 2mil, minimum drill 3mil, track to track 2mil, track to pad 2mil, pad to pad 2mil, via to via 2mil, smd to smd 2mil, copper to edge 5mil, drill to drill 5mil, minimum pad ring 2mil, minimum via ring 2mil, stop-mask expansion 1mil, vias tented up to drill 1mm, thermal gap 0.1mm
tKeepout: area 12,16.4 to 16,20.4; area 0,16.4 to 4,20.4
bKeepout: area 11.9,16.3 to 16.1,20.5; area -0.1,16.3 to 4.1,20.5
tRestrict: area -0.1,16.3 to 4.1,20.5; area 11.9,16.3 to 16.1,20.5
bRestrict: area -0.1,16.3 to 4.1,20.5; area 11.9,16.3 to 16.1,20.5
vRestrict: area 11.9,16.3 to 16.1,20.5

### Footprints (pad centres in the part's own frame; a part is rotated, then mirrored left to right if it is on the bottom)
0201T = smd 0.3 x 0.4: 1 -0.3,0; 2 0.3,0
0402T = smd 0.4 x 0.6: 1 -0.533,0; 2 0.533,0
0402TW = smd 0.4 x 0.8: 1 -0.533,0; 2 0.533,0
LED-0201T = smd 0.2 x 0.35: 1 -0.2,0; 2 0.2,0
0402T-DFN = smd 0.35 x 0.6: A -0.325,0; C 0.325,0
0805PT = smd 0.7 x 1.3: A -1,0; C 1,0
FH23-45S-0.3SHW(05) = smd 0.3 x 1.25: 1 -6.6,0.068; 3 -6,0.068; 5 -5.4,0.068; 7 -4.8,0.068; 9 -4.2,0.068; 11 -3.6,0.068; 13 -3,0.068; 15 -2.4,0.068; 17 -1.8,0.068; 19 -1.2,0.068; 21 -0.6,0.068; 23 0,0.068; 25 0.6,0.068; 27 1.2,0.068; 29 1.8,0.068; 31 2.4,0.068; 33 3,0.068; 35 3.6,0.068; 37 4.2,0.068; 39 4.8,0.068; 41 5.4,0.068; 43 6,0.068; 45 6.6,0.068 | smd 0.3 x 0.6: 2 -6.3,4.468; 4 -5.7,4.468; 6 -5.1,4.468; 8 -4.5,4.468; 10 -3.9,4.468; 12 -3.3,4.468; 14 -2.7,4.468; 16 -2.1,4.468; 18 -1.5,4.468; 20 -0.9,4.468; 22 -0.3,4.468; 24 0.3,4.468; 26 0.9,4.468; 28 1.5,4.468; 30 2.1,4.468; 32 2.7,4.468; 34 3.3,4.468; 36 3.9,4.468; 38 4.5,4.468; 40 5.1,4.468; 42 5.7,4.468; 44 6.3,4.468
X_FL_R_SMT_1(02) = smd 0.5 x 0.7: P$1 0,-1.1 | smd 0.6 x 1.5: P$2 -1,0; P$4 1,0 | smd 0.5 x 0.6: P$3 0,1
0603T = smd 0.7 x 0.9: 1 -0.82,0; 2 0.82,0
1210T = smd 1.5 x 2.5: 1 -1.3,0; 2 1.3,0
0805T = smd 0.7 x 1.3: 1 -1,0; 2 1,0
TP10R = smd 1 x 1: TP 0,0
TP11R = smd 1.1 x 1.1: TP 0,0
TP09R = smd 0.9 x 0.9: TP 0,0
MBGA153-8X8 = smd 0.25 x 0.25: A1 -3.5,3.5; A2 -3,3.5; A3 -2.5,3.5; A5 -1.5,3.5; A7 -0.5,3.5; A9 0.5,3.5; A11 1.5,3.5; A13 2.5,3.5; A14 3,3.5; A15 3.5,3.5; B1 -3.5,3; B2 -3,3; B3 -2.5,3; B4 -2,3; B5 -1.5,3; B6 -1,3; B7 -0.5,3; B8 0,3; B9 0.5,3; B10 1,3; B11 1.5,3; B12 2,3; B13 2.5,3; B14 3,3; B15 3.5,3; C1 -3.5,2.5; C2 -3,2.5; C8 0,2.5; C14 3,2.5; C15 3.5,2.5; D2 -3,2; D4 -2,2; D5 -1.5,2; D6 -1,2; D7 -0.5,2; D8 0,2; D9 0.5,2; D10 1,2; D11 1.5,2; D12 2,2; D14 3,2; E1 -3.5,1.5; E2 -3,1.5; E4 -2,1.5; E5 -1.5,1.5; E6 -1,1.5; E7 -0.5,1.5; E8 0,1.5; E9 0.5,1.5; E10 1,1.5; E11 1.5,1.5; E12 2,1.5; E14 3,1.5; E15 3.5,1.5; F2 -3,1; F4 -2,1; F5 -1.5,1; F11 1.5,1; F12 2,1; F14 3,1; G1 -3.5,0.5; G2 -3,0.5; G4 -2,0.5; G5 -1.5,0.5; G7 -0.5,0.5; G8 0,0.5; G9 0.5,0.5; G11 1.5,0.5; G12 2,0.5; G14 3,0.5; G15 3.5,0.5; H2 -3,0; H3 -2.5,0; H4 -2,0; H5 -1.5,0; H7 -0.5,0; H8 0,0; H9 0.5,0; H11 1.5,0; H12 2,0; H13 2.5,0; H14 3,0; J1 -3.5,-0.5; J2 -3,-0.5; J4 -2,-0.5; J5 -1.5,-0.5; J7 -0.5,-0.5; J8 0,-0.5; J9 0.5,-0.5; J11 1.5,-0.5; J12 2,-0.5; J14 3,-0.5; J15 3.5,-0.5; K2 -3,-1; K4 -2,-1; K5 -1.5,-1; K11 1.5,-1; K12 2,-1; K14 3,-1; L1 -3.5,-1.5; L2 -3,-1.5; L4 -2,-1.5; L5 -1.5,-1.5; L6 -1,-1.5; L7 -0.5,-1.5; L8 0,-1.5; L9 0.5,-1.5; L10 1,-1.5; L11 1.5,-1.5; L12 2,-1.5; L14 3,-1.5; L15 3.5,-1.5; M2 -3,-2; M4 -2,-2; M5 -1.5,-2; M6 -1,-2; M7 -0.5,-2; M8 0,-2; M9 0.5,-2; M10 1,-2; M11 1.5,-2; M12 2,-2; M14 3,-2; N1 -3.5,-2.5; N2 -3,-2.5; N8 0,-2.5; N14 3,-2.5; N15 3.5,-2.5; P1 -3.5,-3; P2 -3,-3; P3 -2.5,-3; P4 -2,-3; P5 -1.5,-3; P6 -1,-3; P7 -0.5,-3; P8 0,-3; P9 0.5,-3; P10 1,-3; P11 1.5,-3; P12 2,-3; P13 2.5,-3; P14 3,-3; P15 3.5,-3; R1 -3.5,-3.5; R2 -3,-3.5; R3 -2.5,-3.5; R5 -1.5,-3.5; R7 -0.5,-3.5; R9 0.5,-3.5; R11 1.5,-3.5; R13 2.5,-3.5; R14 3,-3.5; R15 3.5,-3.5
ASCO = smd 0.6 x 0.5: 1 -0.55,-0.4; 2 0.55,-0.4; 3 0.55,0.4; 4 -0.55,0.4
MICROSIP9-3X2.3 = smd 0.3 x 0.3: A1 -1,0.8; A2 0,0.8; A3 1,0.8; B1 -1,0; B2 0,0; B3 1,0; C1 -1,-0.8; C2 0,-0.8; C3 1,-0.8
X2SON = smd 0.1 x 0.1: 1 -0.43,0.33; 2 -0.43,-0.33; 3 0.43,-0.33; 4 0.43,0.33 | smd 0.1 x 0.1 rotated 45: PAD 0,0
LGA-28-3.8X5.2 = smd 0.25 x 0.475: 1 -2.25,1.56; 6 -2.25,-1.56; 7 -1.75,-1.56; 8 -1.25,-1.56; 9 -0.75,-1.56; 10 -0.25,-1.56; 11 0.25,-1.56; 12 0.75,-1.56; 13 1.25,-1.56; 14 1.75,-1.56; 15 2.25,-1.56; 20 2.25,1.56; 21 1.75,1.56; 22 1.25,1.56; 23 0.75,1.56; 24 0.25,1.56; 25 -0.25,1.56; 26 -0.75,1.56; 27 -1.25,1.56; 28 -1.75,1.56 | smd 0.375 x 0.25: 2 -2.3,0.75; 3 -2.3,0.25; 4 -2.3,-0.25; 5 -2.3,-0.75; 16 2.3,-0.75; 17 2.3,-0.25; 18 2.3,0.25; 19 2.3,0.75
WQFN32-5X5 = smd 0.25 x 0.6: 1 1.75,2.4; 2 1.25,2.4; 3 0.75,2.4; 4 0.25,2.4; 5 -0.25,2.4; 6 -0.75,2.4; 7 -1.25,2.4; 8 -1.75,2.4; 17 -1.75,-2.4; 18 -1.25,-2.4; 19 -0.75,-2.4; 20 -0.25,-2.4; 21 0.25,-2.4; 22 0.75,-2.4; 23 1.25,-2.4; 24 1.75,-2.4 | smd 0.6 x 0.25: 9 -2.4,1.75; 10 -2.4,1.25; 11 -2.4,0.75; 12 -2.4,0.25; 13 -2.4,-0.25; 14 -2.4,-0.75; 15 -2.4,-1.25; 16 -2.4,-1.75; 25 2.4,-1.75; 26 2.4,-1.25; 27 2.4,-0.75; 28 2.4,-0.25; 29 2.4,0.25; 30 2.4,0.75; 31 2.4,1.25; 32 2.4,1.75 | smd 3.1 x 3.1: PAD 0,0
SIT8008BCA7-18E = smd 0.9 x 0.8: 1 -0.75,-0.6; 2 0.75,-0.6; 3 0.75,0.6; 4 -0.75,0.6
DFN6_2X1.3_PAD = smd 0.45 x 0.3: 1 -1,0.4; 2 -1,0; 3 -1,-0.4; 4 1,-0.4; 5 1,0; 6 1,0.4 | smd 1 x 0.8: PAD 0,0
WLCSP3X3 = smd 0.25 x 0.25: A1 -0.5,0.5; A2 0,0.5; A3 0.5,0.5; B1 -0.5,0; B2 0,0; B3 0.5,0; C1 -0.5,-0.5; C2 0,-0.5; C3 0.5,-0.5

### Placement (x,y rotation side)
C1  9.3,14.5 90 bottom
C2  11.5,10.4 270 bottom
C3  8.53,8.78 0 bottom
C4  12,10.4 270 bottom
C5  14.8,12.86 180 bottom
C6  12.6,10.7 270 bottom
C7  14.8,8.6 180 bottom
C8  10.9,10.7 270 bottom
C9  8.17,9.42 0 bottom
C10  13.7,10.89 90 bottom
C11  8.58,6.34 180 bottom
C12  8.1,13 0 bottom
C13  7.8,11.3 0 bottom
C14  13.59,8.75 90 bottom
C15  13.39,14.31 180 bottom
C16  8.1,12.5 0 bottom
C17  7.8,10.8 0 bottom
C18  13.1,8.75 90 bottom
C19  10.31,14.68 90 bottom
C20  8.9,11.42 238.2 bottom
C21  11.25,8.75 90 bottom
C22  15.18,10.48 270 bottom
C23  7.9,13.6 0 bottom
C24  7.2,8.2 180 bottom
C25  12.05,6.25 270 top
C26  5,6.4 270 top
C27  9.35,17.2 90 bottom
C28  6.1,10.5 90 bottom
C29  4.25,5.8 180 bottom
C30  5.6,12.2 0 bottom
C31  7.2,9.3 270 bottom
C32  5.6,11.6 0 bottom
C33  6.65,10.5 90 bottom
C34  7.9,6.12 0 top
C35  11.65,17.15 270 bottom
C36  2.7,13.8 180 bottom
C37  2.7,12.8 180 bottom
C38  2.7,11.8 180 bottom
C39  2.7,13.3 180 bottom
C40  2.7,12.3 180 bottom
C41  2.7,11.3 180 bottom
C43  1,13.1 270 top
C44  1.1,12.8 270 bottom
C45  3.9,14.3 270 bottom
C46  1.7,11.78 283 bottom
C47  2.9,10.6 180 bottom
C49  8.79,5.84 180 bottom
C50  0.8,7.3 90 bottom
C52  12.55,15.19 180 bottom
C53  12.81,15.79 0 top
C71  4.9,7.5 0 top
C72  1.9,8.5 180 top
C75  7.8,6.95 0 top
C76  4.9,8.7 180 top
D1  15.35,15.85 270 top
D2  14.25,15.85 90 top
D3  3.89,16.6 270 top
D9  13.8,6.55 180 top
D10  3,6.3 0 top
J3  8,0.7 0 top
J5  5.77,17.37 0 top
J7  8,0.7 0 bottom
L1  14.8,9.3 0 bottom
L2  7.9,14.5 180 bottom
L3  8,10.2 180 bottom
L4  14.35,7.35 90 bottom
L5  14.84,11.65 0 bottom
L6  3.2,14.9 270 bottom
L7  1.3,10.6 180 bottom
L8  7.78,15.78 0 bottom
L9  10.4,17.55 270 top
L10  8.26,17.61 90 top
R1  14.8,15.85 270 bottom
R2  7.2,6.35 180 bottom
R3  7.2,6.95 180 bottom
R4  10.8,12 180 bottom
R5  4.86,17.06 180 bottom
R6  13.7,15.85 270 bottom
R7  4.16,16.29 0 bottom
R8  5.15,18 180 bottom
R9  5.11,14.22 90 bottom
R10  4.5,14.2 90 bottom
R11  11.8,12.6 270 bottom
R12  12.68,12.51 0 bottom
R13  11.1,13.3 0 bottom
R14  10.25,12.8 180 bottom
R15  3,5.8 0 bottom
R16  7.2,7.6 0 bottom
R17  1.5,15 270 bottom
R18  1.1,13.8 270 bottom
R19  2.5,15.1 270 bottom
R20  2,15.1 90 bottom
R21  13.66,7.16 90 bottom
R22  0.8,8.4 270 bottom
R23  0.8,6.1 270 bottom
R24  12.05,16.19 270 top
R25  7.69,15.9 0 top
R26  5.5,5.77 0 bottom
R27  7.05,5.8 180 bottom
R28  10.3,8.5 270 bottom
R29  15,7.1 270 bottom
R30  13.65,6.2 270 bottom
R48  9.7,15.8 270 bottom
R51  10.3,15.8 90 bottom
R86  1.9,7.9 0 top
R90  4.9,8.1 0 top
TP1  10.54,19.62 180 bottom
TP2  5.46,19.62 180 bottom
TP3  4.19,19.62 180 bottom
TP4  8,19.62 180 bottom
TP5  6.73,19.62 180 bottom
TP6  9.27,19.62 180 bottom
TP7  11.81,19.62 180 bottom
TP8  0.81,6.39 0 top
TP10  0.83,9.49 0 top
TP11  0.81,7.92 0 top
U1  11.8,11.3 0 top
U2  8.57,7.53 90 bottom
U3  7.35,17.6 180 bottom
U4  6.2,6.4 180 top
U5  10.5,17 0 bottom
U6  4,8 0 bottom
U7  4.16,12 0 top
U8  10.6,6.8 180 bottom
U9  12.65,6.85 270 bottom
U25  3.4,8 0 top
U27  6.4,8.1 0 top

### Tracks (layer width: path | path; a pad name or v marks a point on that pad's centre or on a via)
24MHZ_P  (via drill 0.1)
  LowSpeed 0.051: U2.3 9.25,8.36 9.25,10.1 9.95,10.8 U1.J5
  other vias: 10.3,10.8
!IMU_BL
  LowSpeed 0.051: U6.4 6.75,7.75 R16.2
!IMU_RESET
  LowSpeed 0.051: U6.11 3.75,6.25 R15.1
+1V2  (via drill 0.2, 0.3)
  Highspeed1 0.051: 6.86,6.12 6.81,6.07 U4.1
  Highspeed1 0.2: v13.21,2.02 12.8,1.61 J7.7 | v12.5,4.1 J7.8 | C34.1 6.86,6.12 | U4.1 6.31,5.75 v6.25,5.75
  Highspeed1 0.3: v3.2,1.85 J7.39 | v3.25,4.3 3.5,4.55 J7.38
  Highspeed2 0.3: v3.2,1.85 3.2,4.3 v3.25,4.3
  VCC 0.3: v3.2,1.85 3.96,1.09 12.28,1.09 v13.21,2.02 v13.2,2.03 13.2,3.4 v12.5,4.1 | v3.25,4.3 3.95,5 5.5,5 v6.25,5.75
  LowSpeed 0.2: J7.7 12.8,1.61 v13.21,2.02 | J7.8 v12.5,4.1
  LowSpeed 0.3: J7.39 v3.2,1.85 | v3.25,4.3 3.5,4.55 J7.38
+1V8  (via drill 0.1, 0.2, 0.3)
  Highspeed1 0.051: C25.2 12.12,5.97
  Highspeed1 0.15: v12.06,6.23 12.06,5.97 12.12,5.97
  Highspeed1 0.2: U7.28 6.16,11.75 v6.11,11.8 | U7.11 2.31,12.75 v2.31,12.7 | J7.43 v2,0.7 2,0.65 | 14.05,0.65 14.05,0.98 J7.3 14.01,0.85 v14.01,0.66 | J7.42 v2.3,4.6 | v13.7,4.7 J7.4 13.7,5.5 13.5,5.7 12.35,5.7 12.15,5.9 C25.2
  VCC 0.2: v1.16,10.6 1.25,10.6 1.8,10.05 | 14.46,3.6 14.41,3.65
  VCC 0.3: 1.12,4.6 v2.3,4.6 3.8,6.1 4.3,6.1 4.55,6.35 5.15,6.35 | v14.01,0.66 14.46,1.11 14.46,3.6 | 14.41,3.65 13.7,4.36 v13.7,4.7 13.7,6.75 13.85,6.9 v14.15,6.9 | 5.15,6.35 5.15,5.81 v5.45,5.81 | 5.15,6.35 6.8,6.35 7.3,5.85 v7.8,5.85 C49.2 | v7.42,17.2 7.42,16.29
  VCC 0.4: 2.81,12.7 2.81,13.2 3.21,13.6 | 2.81,12.7 2.81,11.06 1.8,10.05 1.8,8.38 1.12,7.7 1.12,4.6 1.12,1.53 2.01,0.64 14.01,0.64 v14.01,0.66 | v2.31,12.7 2.81,12.7 | 5.29,13.6 6.07,14.38 6.07,14.93 7.42,16.29 | 5.29,13.6 3.21,13.6 | 3.21,13.6 3.21,15.01 3.6,15.4 v3.9,15.4 | 5.29,13.6 5.29,12.62 v6.11,11.8
  LowSpeed 0.051: L4.1 14.98,6.82 R29.2 | U8.1 9.85,7.75
  LowSpeed 0.15: v12.06,6.23 12.09,6.2 12.45,6.2 12.65,6 U9.5 | U8.4 U8.1 | L4.1 14.17,6.82 14.15,6.8 | 9.85,7.75 R28.2
  LowSpeed 0.2: R19.1 2.53,15.43 L6.1 | C46.1 | C46.1 C40.1 | 5.9,11.8 C30.1 | 5.9,11.8 C32.1 | v6.11,11.8 5.9,11.8 | v2.3,4.6 J7.42 | v13.7,4.7 J7.4 | v2,0.7 J7.43 2,1.7 2.65,2.35 6.9,2.35 7.4,1.85 7.6,1.85 9.6,3.85 12.32,3.85 12.38,3.8 12.8,3.8 v13.7,4.7 | v14.01,0.66 v14,0.67 J7.3 | v5.45,5.81 v5.45,5.82 R26.2 | v7.8,5.85 7.4,5.85 R27.2 | C49.2 9.45,6.2 U8.4 | L7.1 v1.16,10.6 | 14.15,6.8 14.15,6.67 14.32,6.5 14.32,5.92 13.7,5.3 v13.7,4.7
  LowSpeed 0.203: C37.1 v2.31,12.7
  LowSpeed 0.3: L6.1 3.23,15.4 v3.9,15.4 | C40.1 C37.1 | U3.A1 U3.A2 7.42,16.87 v7.42,17.2
  other vias: 9.09,5.84
+3V3  (via drill 0.1, 0.2)
  Highspeed1 0.2: U1.J8 U1.H9 12.4,11.3 v12.8,10.9 | U1.G8 U1.H7 11,11.3 v10.8,11.5 | U7.25 v7.01,10.25 | C26.1 5.1,7 | 5.65,6.73 U4.3 | 5.65,6.73 5.65,6.5 5.62,6.47 5.62,6.22 U4.4 | C26.1 5.2,6.73 5.65,6.73 | U25.C3 C71.1 v4.6,7.35 4.6,7.33 C26.1 | U27.C3 R16.1 C75.1
  VCC 0.1: 5.79,19.5 5.72,19.57
  VCC 0.2: v4.86,18.52 5.79,19.45 5.79,19.5
  LowSpeed 0.051: R4.1 10.8,11.7 v10.8,11.5 | v9.5,12.75 9.55,12.8 R14.1 | U2.1 U2.4 | C11.2 8.85,6.37 v8.85,6.6 | C75.1 R2.2 7.69,6.16 v7.89,6.16 | v4.86,18.52 v4.85,18.51 R8.1 4.56,17.71 R5.1 | R9.2 5.09,14.5 R10.2 4.5,14.66 v4.73,14.89 | R6.1 v13.7,16.13 | R1.1 v14.8,16.13
  LowSpeed 0.1: R17.1 1.45,15.35 v1.45,16.2
  LowSpeed 0.15: 6.6,8.25 6.66,8.26 6.66,8.76 v6.75,8.85
  LowSpeed 0.2: C2.1 11.75,10.7 | 11.75,10.7 C4.1 | 11.75,10.7 11.75,10.75 arc-90 U1.J8 | v12.8,11.5 12.6,11.3 C6.1 | v10.8,11.5 10.9,11.4 C8.1 | C31.1 L3.1 arc90 7.42,10.25 v7.01,10.25 arc-16 C33.1 C28.1 5.75,9.85 U6.28 | U6.3 6.6,8.25 6.85,8.25 C24.1 | U2.4 8.85,6.86 v8.85,6.6 | v11.3,13.7 11.4,13.6 R13.1 | TP6.TP 9.16,19.62 v8.95,19.83
  LowSpeed 0.203: L5.1 15.47,11.45 v15.51,11.41 | R12.1 v13,12.5 | L1.1 15.33,9.27 v15.29,9.23 | L2.1 v7.38,14.49
  LowSpeed 0.3: U5.1 11.28,17.68 C35.1
  other vias: 11.8,10.8 7.5,7.6 10.7,11.1 12.6,11.15 2.7,5.8 11.7,17.93 11.55,17.68 11.85,17.68 12.05,17.43
  pour VCC (rank 3, no thermals): 0,20.35 0,-10.6 16,-10.6 16,20.35
  pour LowSpeed (no thermals): 11.45,17.45 11.45,18.15 12.05,18.15 12.05,17.7 12.3,17.45 12.1,17.2 11.85,17.45
BNO_SCL  (via drill 0.1)
  Highspeed1 0.051: U1.L1 8,9.5 8,7.62 v7.94,7.56
  LowSpeed 0.051: U6.19 2.25,8.2 2.25,7.15 2.5,6.9 4.3,6.9 6.25,6.9 6.4,6.75 6.41,6.75 6.81,6.35 R2.1 7.2,6.65 7.2,7.15 7.35,7.3 7.68,7.3 v7.94,7.56
BNO_SDA  (via drill 0.1)
  Highspeed1 0.051: v8.95,10.17 8.82,10.3 U1.K2
  Highspeed2 0.051: v5.64,7.08 5.66,7.1 6.9,7.1 | 6.9,7.1 6.95,7.1 7,7.15 7,7.75 7.15,7.9 7.65,7.9 7.9,8.15 7.9,9.3 7.92,9.32 8.78,10.17 v8.95,10.17 | 6.9,7.1 6.95,7.05 v6.95,7
  LowSpeed 0.051: U6.20 1.75,9.25 2.45,8.55 2.45,7.4 2.77,7.08 v5.64,7.08 | 6.95,7.04 R3.1 v6.95,7
CAL_1.3KHZ  (via drill 0.1)
  Highspeed1 0.051: U1.N8 11.6,9 9.6,9 9.43,9.18 9.43,10.22 9.15,10.5 7.91,10.5 7.12,9.71 6.44,9.71 6.05,10.1 v3.95,10.1
  LowSpeed 0.051: 0.77,8.79 0.77,8.73 R22.1 0.8,8.75 0.72,8.83 0.72,9.52 1.15,9.95 3.8,9.95 v3.95,10.1
CAL_SIGNAL  (via drill 0.1)
  Highspeed1 0.051: v2.3,2.74 3.51,2.74 4.4,1.85 J3.11 4.4,0.29
  Highspeed2 0.051: v2.3,2.74 2.3,1.95 3.95,0.3 10.15,0.3 v11.6,1.75
  LowSpeed 0.051: J7.11 v11.6,1.75 | R22.2 C50.2 0.8,7.46 0.52,7.18 0.52,6.82 0.8,6.54 R23.1 0.8,6.26 0.52,5.98 0.52,4.52 v2.3,2.74
CONF_DONE  (via drill 0.1)
  LowSpeed 0.051: U1.E6 R14.2
  other vias: 10.8,12.8
CONFIG_SEL  (via drill 0.1)
  Highspeed1 0.09: U1.D8
  LowSpeed 0.051: R11.1 U1.D8
  other vias: 11.8,13.3
DEBUG0
  Highspeed1 0.051: U1.E14 15.09,13.09
  Highspeed1 0.09: 14.93,12.8 U1.E14
DEBUG1
  Highspeed1 0.051: U1.E15 15.35,12.85
DEBUG6
  Highspeed1 0.09: 15.39,9.8 U1.L15
DEBUG7
  Highspeed1 0.09: U1.N15
DIN0  (via drill 0.1)
  Highspeed1 0.051: U7.19 v3.4,9.15 | U1.A5 10.7,14.8 v10.75,14.85
  Highspeed2 0.051: v3.4,9.15 4.54,10.29 5.1,10.29 6.46,11.66 6.46,14 7.26,14.8 10.7,14.8 v10.75,14.85
DIN1  (via drill 0.1)
  Highspeed1 0.051: v4,9.1 3.91,9.19 U7.20
  Highspeed2 0.051: v4,9.1 4,9.24 4.76,10 5.1,10 6.7,11.6 6.7,13.5 7.3,14.1 8.2,14.1 8.6,14.5 11.6,14.5 U1.B8
  other vias: 11.8,14.3
DIN2  (via drill 0.1)
  Highspeed1 0.051: U7.21 v4.4,9.15 | U1.B4 9.85,14.3 v10.1,14.05
  Highspeed2 0.051: v4.4,9.15 5.05,9.8 5.2,9.8 7,11.6 7,12.43 8.62,14.05 v10.1,14.05
DIN3  (via drill 0.1)
  Highspeed1 0.051: U7.22 v4.9,9.1
  Highspeed2 0.051: v4.9,9.1 4.9,9.12 7.24,11.46 7.24,11.6 8.6,12.96 9.07,12.96 9.75,13.63 10.13,13.63 U1.B6
  other vias: 10.8,14.3
DIN4  (via drill 0.1)
  Highspeed1 0.051: U7.23 v5.4,9.15
  Highspeed2 0.051: 9.32,12.82 8,11.5 7.7,11.5 5.4,9.2 v5.4,9.15 | U1.B7 10.53,13.53 10.53,13.18 10.4,13.05 9.55,13.05 9.43,12.93 | 9.43,12.93 | 9.43,12.93 9.32,12.82 | 9.32,12.82
  other vias: 11.3,14.3
DIN5  (via drill 0.1)
  Highspeed1 0.051: U7.24 5.91,9.32 v5.7,9.11 | v13.39,14.03 13.3,14.12 U1.B11
  Highspeed2 0.051: v5.7,9.11 6.66,10.07 7.08,10.07 9.58,12.57 10.97,12.57 11.3,12.9 11.3,13.4 11.85,13.95 13.31,13.95 v13.39,14.03
DIN6
  Highspeed1 0.051: U7.26 6.71,10.75 7.42,11.46 7.42,11.63 8.14,12.35 | U1.E2 8.65,12.8 8.2,12.35 8.14,12.35 | 8.14,12.35
DIN7
  Highspeed1 0.051: 8.12,12.8 U1.E1 8.1,12.8 7.75,12.45 7.58,12.45 7.15,12.01 7.15,11.69 6.71,11.25 U7.27
DIN8
  Highspeed1 0.051: U1.D2 8.7,13.3 8.5,13.1 7.62,13.1 6.77,12.25 U7.29
DIN9
  Highspeed1 0.051: U1.C2 8.4,13.4 7.6,13.4 6.95,12.75 U7.30
DIN10
  Highspeed1 0.051: U1.C1 8.25,13.85 8.25,13.9 7.4,13.9 6.74,13.25 U7.31
DIN11
  Highspeed1 0.051: U1.B1 7.4,14.3 6.85,13.75 U7.32
GND  (via drill 0.1, 0.2, 2.1 pad 3)
  Highspeed1 0.15: v0.8,14.13 0.9,14.12 0.9,14.1
  Highspeed1 0.2: U1.G9 U1.H8 U1.J7 10.9,10.4 C8.2 | U4.2 v6.58,6.86 | U1.D5 U1.E5 U1.E4 | C25.1 12.1,6.5 v11.99,6.5
  GND1 0.2: v13.55,8.91 14.05,8.41 14.05,8.23 14.23,8.05 15,8.05 15.26,7.8
  LowSpeed 0.051: R7.2 v3.85,16.93
  LowSpeed 0.1: C12.2 7.8,12.79 | 7.8,12.79 C16.2 | 7.8,12.79 v7.71,12.74
  LowSpeed 0.15: R18.1 1.07,14.13 v0.8,14.13
  LowSpeed 0.2: C6.2 arc-90 12.53,10.1 C4.2 C2.2 10.97,10.1 arc-90 C8.2 | C13.2 v7.5,11.05 C17.2 | C11.1 8.26,6.36 v8.08,6.36 | v2,18.4 2,16.26 | v14,18.4 14,16.5 14.22,16.28 14.3,16.28
  LowSpeed 0.203: R7.2
  LowSpeed 0.3: C35.2 11.67,16.6 v12.55,16.6
  other vias: 3.6,13.2 4.2,13.2 4.8,13.2 4.8,12.7 4.2,12.7 3.6,12.7 3.6,12.2 3.6,11.7 4.2,12.2 4.2,11.7 3.6,11.2 4.2,11.2 12.3,11.8 4.8,12.2 4.8,11.7 12.6,10.15 12.3,13.3 14.25,12.25 13.18,16.18 14.24,9.81 7.37,13.61 8.3,8.8 8.3,7.8 7.5,8.2 10.9,10.17 9.8,11.8 9.2,10.95 6.95,9.1 7.7,9.1 10.3,13.3 13.8,12.8 4.6,8.7 5.1,7.65 1.4,8.5 11,7.4 11.73,4.56 14.28,5.16 9.8,1.65 8.3,1.7 6.25,1.7 7.55,2.25 10.8,3.6 7.6,4.15 5.2,3.35 3.9,3.65 10.5,17.25 7.97,14.51 15,5.5 6.67,18.51 7.17,18.66 8.17,18.06 8.92,17.41 9.97,17.86 3.97,17.41 3.22,16.61 2.27,16.26 1.77,15.91 0.92,15.06 3.27,15.81 4.07,15.86 12.82,11.96 11.32,12.41 13.57,10.06 2.97,8.86 2.12,3.86 1.87,2.11 11.98,19.78 11.53,19.88 2.4,1.5 12.9,4.6 0.72,0.69 0.5,1.53 0.46,2.77 0.5,4.01 15.12,0.78 15.44,1.49 15.38,2.72 15.32,3.65 13.89,2.66 13.71,1.72 12.36,1.76 9.11,4.02 5.85,3.55 4.82,4.09 4.76,2.93 3.88,2.95 4.17,8.72 0.97,11.32 0.52,11.57 0.53,12.79 0.5,13.54 0.47,14.65 0.6,15.8 15.48,13.39 15.49,12.26 15.13,10.53 9.07,9.93 4.88,16.04 4.43,18.4 1.23,8.99 7.44,12.05 6.85,9.89 13.55,8.01 6,13 10.7,5.7
  pour LowSpeed: 2.6,14.1 2.6,10.3 5.7,10.3 5.7,13.6 4.1,13.6 4.1,14.1
  pour GND2 (rank 3, no thermals): 0,20.35 0,-9.6 16,-9.6 16,20.35
  pour GND1 (rank 3): -42,58.5 -42,-8.5 58,-8.5 58,58.5
  pour LowSpeed (rank 3): 0,20.35 0,-11.65 16,-11.65 16,20.35
  pour Highspeed1 (rank 3): 0,20.35 0,-7.3 16,-7.3 16,20.35
HSYNC
  Highspeed1 0.051: U1.A2 8.5,15.1 6.61,15.1 U7.1
I2C_SCL_A  (via drill 0.1)
  Highspeed1 0.051: J3.19 6.8,1.73 7.37,2.3 7.37,2.32 7.48,2.43 7.5,2.43 8.05,2.98 | 8.05,2.98 8.41,3.34 10.19,3.34 11.61,4.76 11.61,6.86 12.2,7.45 12.2,7.7 U1.R9 | 8.05,2.98 v8.05,3
  LowSpeed 0.051: R27.1 6.78,5.78 6.78,4.28 v8.05,3
I2C_SCL_B  (via drill 0.1)
  Highspeed1 0.051: U1.R14 v14.9,7.8
  LowSpeed 0.051: J7.19 9.2,1.4 11.4,3.6 14.3,3.6 15.31,4.61 15.31,7.09 R29.1 14.9,7.5 v14.9,7.8
I2C_SDA_A  (via drill 0.1)
  Highspeed1 0.051: 6.5,5.1 J3.18 6.5,4.75 v6.08,4.33
  Highspeed2 0.051: U1.L6 10.5,10.1 9.7,10.1 9.48,9.88 9.48,7.45 9.11,7.09 8.56,7.09 6.08,4.61 v6.08,4.33
  LowSpeed 0.051: R26.1 6.08,5.54 6.13,5.5 6.13,4.37 v6.08,4.33
  other vias: 10.8,9.8
I2C_SDA_B  (via drill 0.1)
  Highspeed2 0.051: v9.15,4.75 10.9,6.5 10.9,7.25 10.82,7.33 10.82,7.47 10.9,7.55 10.9,8.8 11.15,9.05 11.6,9.05 11.8,9.25 U1.M8
  LowSpeed 0.051: J7.18 9.5,5.1 v9.15,4.75 | R28.1 10.75,8.8 10.87,8.93 11.63,8.93 11.8,9.1 U1.M8
  other vias: 11.8,9.3
JTAGEN  (via drill 0.1)
  LowSpeed 0.051: R4.2 U1.G7
  other vias: 11.3,11.8
LH_DATA1  (via drill 0.1)
  Highspeed1 0.051: v9.3,11.45 U1.H3
  Highspeed2 0.051: U25.C1 3.6,8.2 4.85,8.2 5.48,8.83 5.67,8.83 6.47,9.64 6.89,9.64 8.25,11 8.85,11 v9.3,11.45
  other vias: 2.9,7.5
LH_DATA2  (via drill 0.1)
  Highspeed1 0.051: U1.G5 10.3,11.84 v10.1,12.04
  Highspeed2 0.051: U27.C1 6.4,8.1 6.75,8.1 7.2,8.55 7.2,9.2 8.6,10.6 9.3,10.6 10.1,11.4 v10.1,12.04
  other vias: 5.9,7.6
LH_ENV1  (via drill 0.1)
  Highspeed1 0.051: U1.J2 v8.7,10.8
  Highspeed2 0.051: U25.C2 3.95,8.05 4.95,8.05 5.55,8.65 5.8,8.65 6.54,9.39 6.9,9.39 8.31,10.8 v8.7,10.8
  other vias: 3.4,7.5
LH_ENV2  (via drill 0.1)
  Highspeed1 0.051: U27.C2 6.1,7.3 v5.9,7.3 | v10.8,12.35 10.75,12.3 U1.F5
  Highspeed2 0.051: v5.9,7.3 6.25,7.3 7.5,8.55 7.5,9.2 8.7,10.4 9.4,10.4 10.6,11.6 10.6,12.15 v10.8,12.35
MIDFILT  (via drill 0.2)
  Highspeed1 0.2: 10.51,19.19 10.5,19.2 10.24,19.2 9.65,18.61 | R25.2 8.01,15.93 v7.95,16.03 | 10.39,18.61 L9.1 | 10.39,18.61 9.89,18.61 | 10.54,17.85 10.54,18.61 10.39,18.61 | R24.1 12.05,17.05 11.85,17.25 11.45,17.25 10.85,17.85 10.54,17.85 | v10.54,17.8 10.54,17.85
  Highspeed1 0.5: L10.2 9.65,18.61 9.89,18.61
  Highspeed2 0.2: v7.95,16.03 v10.54,17.8
N$1
  LowSpeed 0.051: U9.6 11.7,5.85 U8.3 11.35,6.25 11.95,6.85 11.95,7.45 12.15,7.65 U9.1
N$2
  LowSpeed 0.051: U9.4 13.65,6.45 R30.1
N$3  (via drill 0.1)
  Highspeed1 0.051: 11.6,0.7 J3.35 | J3.35 11.6,0.31 11.61,0.3 | J3.35 11.6,1.35 15.31,5.06 15.31,7.15 15.11,7.34 14.64,7.34 13.93,7.34 v13.9,7.37
  LowSpeed 0.051: R21.2 13.75,7.37 v13.9,7.37
N$4  (via drill 0.1)
  LowSpeed 0.2: L3.2 8.53,10.37 C17.1 C13.1 U1.H2 8.62,11.48 C20.1
  other vias: 8.8,11.3
N$5  (via drill 0.1)
  Highspeed2 0.051: v4.6,1.55 4.95,1.2 6.78,1.2 v11.2,5.62
  LowSpeed 0.051: v4.6,1.55 4.4,1.35 J7.35 | v11.2,5.62 11.9,5.62 11.97,5.55 13.23,5.55 13.58,5.9 R30.2
N$6
  LowSpeed 0.051: U9.2 12.65,7.77 12.91,7.51 13,7.51 13.65,6.86 R21.1
N$7
  Highspeed1 0.051: U25.A3 3.7,8.3 3.7,6.6 D10.C
N$8
  Highspeed1 0.051: D10.A 2.45,6.3 3.15,7 3.15,8.25 U25.A2
N$9
  Highspeed1 0.2: R86.2 2.2,8 U25.B1
N$10
  cutout GND1: 0,18.4 arc-90 2,20.4 arc-90 4,18.4 arc-90 2,16.4 arc-90
N$11
  cutout LowSpeed: 0,18.4 arc-90 2,20.4 arc-90 4,18.4 arc-90 2,16.4 arc-90
N$12
  Highspeed1 0.2: C72.1 U25.A1
N$13  (via drill 0.2)
  Highspeed1 0.2: 10.65,16.85 10.4,16.6 L9.2 | R24.2 12.02,15.86 v12.02,15.17
  Highspeed1 0.3: 10.65,16.75 10.65,16.85 | L9.2 10.14,15.99 v8.6,15.99
  LowSpeed 0.2: v12.02,15.17 C52.1
  LowSpeed 0.3: L8.1 v8.6,15.99
  pour Highspeed1 (no thermals): 10.1,16.7 10.1,15.3 12.6,15.3 12.6,16.1 11.1,16.1 11.1,16.7
N$14  (via drill 0.1)
  Highspeed1 0.051: v13.25,6.7 12.95,6.7 D9.C
  Highspeed2 0.051: U27.A3 6.65,8.35 6.29,8.35 4.35,6.41 4.35,0.95 4.55,0.75 8.4,0.75 10.5,2.85 11.9,2.85 13.33,4.28 13.33,6.62 v13.25,6.7
  other vias: 6.9,8.6
N$15  (via drill 0.1)
  Highspeed1 0.051: v14.07,6.4 14.46,6.4 14.57,6.51 14.65,6.51 14.77,6.4 D9.A | v6.5,9.04 6.5,8.7 U27.A2
  Highspeed2 0.051: v14.07,6.4 13.43,5.77 13.43,4.23 11.95,2.75 11.94,2.75 10.54,2.75 8.44,0.65 4.51,0.65 4.25,0.91 4.25,6.45 6.5,8.7 v6.5,9.04
N$16
  Highspeed1 0.2: U27.B1 R90.2
N$17
  cutout VCC: 0,18.4 arc-90 2,20.4 arc-90 4,18.4 arc-90 2,16.4 arc-90
N$18
  cutout GND2: 0,18.4 arc-90 2,20.4 arc-90 4,18.4 arc-90 2,16.4 arc-90
N$19
  cutout Highspeed1: 0,18.4 arc-90 2,20.4 arc-90 4,18.4 arc-90 2,16.4 arc-90
N$20
  cutout GND1: 12,18.4 arc-90 14,20.4 arc-90 16,18.4 arc-90 14,16.4 arc-90
N$21
  cutout LowSpeed: 12,18.4 arc-90 14,20.4 arc-90 16,18.4 arc-90 14,16.4 arc-90
N$22
  cutout VCC: 12,18.4 arc-90 14,20.4 arc-90 16,18.4 arc-90 14,16.4 arc-90
N$23
  cutout GND2: 12,18.4 arc-90 14,20.4 arc-90 16,18.4 arc-90 14,16.4 arc-90
N$24
  cutout Highspeed1: 12,18.4 arc-90 14,20.4 arc-90 16,18.4 arc-90 14,16.4 arc-90
N$28
  Highspeed1 0.15: 1.1,12.72 C43.2 | C43.2 1,12.78 | C43.2 C43.2 arc45 0.8,12.32 arc66 1.14,11.8 1.25,11.75 U7.13
N$30  (via drill 0.1)
  Highspeed1 0.2: U7.9 1.66,13.85 v1.66,13.95
  LowSpeed 0.1: v1.66,13.95 1.5,14.11 R17.2
N$31  (via drill 0.1)
  Highspeed1 0.15: v1.16,12.3 1.71,12.3 U7.12
  LowSpeed 0.15: v1.16,12.3 1.1,12.36 C44.2
N$32
  LowSpeed 0.15: C44.1 R18.2
N$33  (via drill 0.2)
  Highspeed1 0.09: U7.8
  Highspeed1 0.2: v2.08,14.42 2.1,14.4 U7.8
  LowSpeed 0.3: R19.2 R20.1 2.08,14.72 v2.08,14.42
N$34  (via drill 0.1)
  Highspeed1 0.2: U7.10 2.26,13.25 v2.31,13.3
  LowSpeed 0.051: C39.1 v2.31,13.3
  LowSpeed 0.2: C39.1 C36.1 2.97,14.37 L6.2 3.58,14.75 3.8,14.75 C45.1
N$35  (via drill 0.2)
  Highspeed1 0.2: U7.14 v2.23,11.26
  LowSpeed 0.2: L7.2 C47.1 2.37,11.27 C41.1 | C41.1 C38.1 | C41.1 2.27,11.3 v2.23,11.26
N$36
  Highspeed1 0.2: U27.A1 5.3,8.6 C76.1
N$52  (via drill 0.1)
  Highspeed1 0.09: 9.8,13.22 U1.D4
  LowSpeed 0.051: U1.D4 9.9,13.4 9.9,15 9.7,15.2 R48.2 R51.2
  other vias: 9.8,13.3
N$67
  LowSpeed 0.051: U6.9 4.75,6.1 4.55,5.9 C29.2
N$92  (via drill 0.1)
  Highspeed1 0.051: v13.75,15.55 D2.2
  LowSpeed 0.051: R6.2 v13.75,15.55
N$93  (via drill 0.1)
  Highspeed1 0.051: v15.25,15.55 D1.2
  LowSpeed 0.051: R1.2 v15.25,15.55
NCONFIG  (via drill 0.1)
  Highspeed1 0.051: U1.E8 12.15,12.45 v12.3,12.45
  LowSpeed 0.051: R12.2 12.36,12.51 v12.3,12.45
NRST_A
  Highspeed1 0.051: U1.P8 11.95,8.15 11.95,7.45 10.98,6.48 10.98,4.76 9.82,3.59 7.2,3.59 5.6,1.99 J3.15
NRST_B  (via drill 0.1)
  Highspeed1 0.051: v15.5,7.5 15.5,7.71 15.5,7.72 15.5,8.1 U1.P15
  LowSpeed 0.051: 10.4,1.1 10.4,1.3 | v15.5,7.5 15.5,4.45 14.3,3.25 11.75,3.25 10.2,1.7 10.2,1.3 10.4,1.1 | 10.4,1.1 J7.15
NSTATUS  (via drill 0.1)
  LowSpeed 0.051: 10.9,13.3 U1.D6
  other vias: 10.8,13.3
OSC_PDOWN_N_A  (via drill 0.1)
  Highspeed1 0.051: v4.7,4.6 J3.12 | v8.29,7.5 8.54,7.76 8.54,7.89 8.73,8.08 9.08,8.08 U1.P3
  Highspeed2 0.051: v4.7,4.6 4.7,5.86 5.42,6.58 7.15,6.58 7.86,7.29 8.08,7.29 v8.29,7.5
OSC_PDOWN_N_B  (via drill 0.1)
  Highspeed2 0.051: U1.L10 12.8,9.05 13,8.85 13,7.85 11.8,6.65 11.8,5.25 11.3,4.75 v11.3,4.12
  LowSpeed 0.051: J7.12 v11.3,4.12
  other vias: 12.8,9.8
PCLK  (via drill 0.1)
  Highspeed1 0.051: 4.9,14.3 4.91,14.11 U7.3 4.91,14.71 v5.5,15.3 | v13.6,14.9 13.5,14.8 U1.A11
  Highspeed2 0.051: v5.5,15.3 5.6,15.4 13.1,15.4 v13.6,14.9
PSB_CLK_A  (via drill 0.1)
  Highspeed1 0.051: v11.42,2.26 11,1.84 J3.33
  Highspeed2 0.051: U1.K4 10.08,10.58 12.89,10.58 13.22,10.25 13.22,9.72 13.8,9.15 13.8,7.8 14.47,7.13 14.47,4.77 11.96,2.26 v11.42,2.26
  other vias: 9.8,10.3
PSB_CLK_B  (via drill 0.1)
  Highspeed2 0.051: v5,1.7 5,2.2 10.1,7.3 10.1,9.5 U1.L4
  LowSpeed 0.051: J7.33 v5,1.7
  other vias: 9.8,9.8
PSB_DATA_0_A  (via drill 0.1)
  Highspeed1 0.051: J3.31 v10.4,1.55 | v14.56,7.52 14.3,7.78 U1.R13
  Highspeed2 0.051: v10.4,1.55 10.88,2.02 12.32,2.02 14.7,4.4 14.7,7.38 v14.56,7.52
PSB_DATA_0_B  (via drill 0.1)
  Highspeed1 0.051: U1.M7 11.3,9.39 v11.55,9.64
  Highspeed2 0.051: v5.9,1.8 10.7,6.6 10.7,9 10.96,9.26 11.17,9.26 v11.55,9.64
  LowSpeed 0.051: J7.31 5.6,1.5 v5.9,1.8
PSB_DATA_1_A
  Highspeed1 0.051: U1.R7 11.3,7.45 10.1,6.25 J3.30
PSB_DATA_1_B  (via drill 0.1)
  Highspeed2 0.051: v5.75,4 6.55,4 9.9,7.35 9.9,9.2 U1.M4
  LowSpeed 0.051: J7.30 5.9,4.15 v5.75,4
  other vias: 9.8,9.3
PSB_DATA_2_A
  Highspeed1 0.051: 9.5,5.5 J3.28 9.5,6.1 10.8,7.4 U1.P6
PSB_DATA_2_B  (via drill 0.1)
  Highspeed1 0.051: U1.P4 9.8,8.25 v9.7,8.15
  Highspeed2 0.051: 9.7,8.2 v9.7,8.15 9.7,7.4 9.18,6.92 8.92,6.92 8.78,6.78 | v6.5,4.45 7.65,5.6 7.85,5.6 8.35,6.1 8.35,6.35 8.67,6.67 | 8.78,6.78 | 8.78,6.78 8.67,6.67 | 8.67,6.67
  LowSpeed 0.051: J7.28 v6.5,4.45
PSB_DATA_3_A
  Highspeed1 0.051: J3.27 9.2,1.62 10.19,2.6 12.55,2.6 14.65,4.7 14.65,5.45 14.2,5.9 14.13,5.9 13.7,6.33 13.7,7.8 13.8,7.9 U1.P12
PSB_DATA_3_B  (via drill 0.1)
  Highspeed1 0.051: U1.L8 v11.8,9.75
  Highspeed2 0.051: v6.8,2.1 11.25,6.55 11.25,7.85 12.05,8.65 12.05,9.5 v11.8,9.75
  LowSpeed 0.051: J7.27 v6.8,2.1
PSB_DATA_4_A
  Highspeed1 0.051: J3.25 8.6,1.68 9.77,2.85 12.3,2.85 14,4.55 14,5.6 13.43,6.17 13.43,7.67 U1.R11
PSB_DATA_4_B  (via drill 0.1)
  Highspeed2 0.051: v7.9,1.8 11.6,5.5 11.6,7.3 12.55,8.25 12.55,9.55 U1.L9 12.5,9.6
  LowSpeed 0.051: v7.9,1.8 7.4,1.3 J7.25
  other vias: 12.3,9.8
PSB_DATA_5_A
  Highspeed1 0.051: U1.P7 11.7,7.9 11.7,7.55 10.42,6.27 10.42,4.72 10.1,4.4 9.06,4.4 J3.24
PSB_DATA_5_B  (via drill 0.1)
  Highspeed2 0.051: v7.7,4.6 8.57,5.47 9.05,5.47 9.43,5.85 9.43,6.33 10.3,7.2 U1.M5
  LowSpeed 0.051: J7.24 v7.7,4.6
  other vias: 10.3,9.3
PSB_DATA_6_A
  Highspeed1 0.051: J3.22 7.7,5.3 8,5.6 8.62,5.6 8.78,5.76 8.78,5.88 10.3,7.4 U1.R5
PSB_DATA_6_B  (via drill 0.1)
  Highspeed1 0.051: U1.L7 v11.3,9.75
  Highspeed2 0.051: v8.3,4.7 8.5,4.7 10.51,6.71 10.51,9.15 11.11,9.75 v11.3,9.75
  LowSpeed 0.051: J7.22 v8.3,4.7
PSB_SYNC_A
  Highspeed1 0.051: J3.21 7.4,1.6 8.89,3.09 10.59,3.09 12.21,4.71 12.21,5.41 12.06,5.56 11.98,5.56 11.77,5.77 11.77,6.73 12.65,7.61 12.65,7.95 U1.P9
PSB_SYNC_B  (via drill 0.1)
  Highspeed1 0.051: v13.23,9.42 13.3,9.35 U1.M11
  Highspeed2 0.051: v8.8,1.6 10.4,3.2 11.3,3.2 12.12,4.03 12.12,4.92 12.5,5.3 12.5,6.65 13.3,7.45 13.3,9.35 v13.23,9.42
  LowSpeed 0.051: J7.21 8.6,1.4 v8.8,1.6
REC_NRST_A  (via drill 0.1)
  Highspeed1 0.051: J3.16 5.9,4.75 v5.7,4.55 | U1.R3 9.3,7.7 v9.13,7.53
  Highspeed2 0.051: v9.13,7.53 8.68,7.53 v5.7,4.55
REC_NRST_B  (via drill 0.1)
  Highspeed2 0.051: v9.7,4.7 10.22,5.22 10.47,5.22 10.97,5.72 10.97,5.97 11.4,6.4 11.4,7.45 12.32,8.38 12.32,9.28 U1.M9
  LowSpeed 0.051: J7.16 10.1,5.1 v9.7,4.7
  other vias: 12.3,9.3
SERDES_GPIO0  (via drill 0.1)
  Highspeed1 0.051: U7.15 2.05,10.75 2.19,10.61 2.19,10.07 2.1,9.98 2.1,9.46 2.02,9.38 | v2.4,9 2.02,9.38 | TP11.TP 0.81,8.17 2.02,9.38 | 11.3,14.82 U1.A7
  Highspeed2 0.051: v2.4,9 3.98,10.57 4.8,10.57 5.7,11.47 5.7,13.7 7.05,15.05 11.05,15.05 U1.A7
  other vias: 11.3,14.8
SERDES_GPIO1  (via drill 0.1)
  Highspeed1 0.051: 0.83,9.32 TP10.TP | U7.16 0.83,9.32 | v0.9,9.3 0.83,9.2 0.83,9.32 | v12.54,14.87 12.37,14.87 U1.A9
  Highspeed2 0.051: v0.9,9.3 1.99,9.3 3.5,10.81 3.53,10.82 4.5,10.82 5.4,11.72 5.4,13.9 6.72,15.22 11.4,15.22 11.75,14.87 v12.54,14.87
SERDES_SCL  (via drill 0.1)
  Highspeed1 0.051: v13.9,15.2 U1.A13 | v4.86,15.29 4.41,14.84 U7.4 4.41,14.1 4.55,13.96 v5.11,13.96
  Highspeed2 0.051: v4.86,15.29 5.12,15.55 13.4,15.55 13.75,15.2 v13.9,15.2
  LowSpeed 0.2: R9.1 v5.11,13.96
SERDES_SDA  (via drill 0.1)
  Highspeed1 0.051: U7.5 3.91,14.79 | U7.5 v3.91,14.39 | U7.5 3.91,14.81 v4.4,15.3 | U1.A14 14.8,14.95 v14.55,15.2
  Highspeed2 0.051: v4.4,15.3 4.95,15.85 7.57,15.85 7.66,15.76 8.88,15.76 8.97,15.85 13.9,15.85 v14.55,15.2
  LowSpeed 0.051: v3.91,14.39 4.01,14.39 R10.1
SIGOUT
  Highspeed1 0.15: C43.1 1.04,13.48 arc-45 1.7,15.17 2.09,15.57 arc-45 3.79,16.27 D3.C J5.P$1
  Highspeed1 0.2: R25.1 7.42,15.91
  Highspeed1 0.203: D3.C
  pour Highspeed1 (no thermals): 5.55,16.45 5.55,15.9 7.6,15.9 7.6,16.15 7.7,16.25 8.5,16.25 8.49,16.86 7.6,16.86 7.6,16.45
STATUS_A  (via drill 0.1)
  Highspeed1 0.051: 15.26,13.76 U1.C15 | D1.1 15.35,16.29 v15.33,16.31
  Highspeed2 0.051: U1.C15 15.3,14.05 15.48,14.23 15.48,16.16 v15.33,16.31
  other vias: 15.3,13.8
STATUS_B  (via drill 0.1)
  Highspeed1 0.051: D2.1 v14.3,15.7
  Highspeed2 0.051: U1.B15 15.3,14.7 v14.3,15.7
  other vias: 15.3,14.3
TCK  (via drill 0.1)
  Highspeed1 0.051: v7.1,10.6 7.3,10.8 U1.J1
  LowSpeed 0.051: TP3.TP 4.17,19.59 | 4.17,19.59 4.11,19.53 | v7.1,10.6 7.1,11.4 6.3,12.2 6.3,13.4 5.55,14.15 5.55,14.9 4.46,15.99 R7.1 4.17,16.59 4.17,19.59
  LowSpeed 0.1: 4.07,19.74 TP3.TP
TDI  (via drill 0.1)
  Highspeed1 0.051: U1.H5 v10.43,11.18
  LowSpeed 0.051: TP4.TP 8.15,19.62 7.46,18.93 5.83,18.93 5.45,18.55 R8.2 5.47,17.98 5.47,16.05 6.6,14.93 8.78,14.93 8.85,14.85 8.85,12.75 9.3,12.3 9.3,12.05 10.18,11.18 v10.43,11.18
  LowSpeed 0.1: 8,19.8 TP4.TP
TDO  (via drill 0.1, 0.2)
  Highspeed1 0.051: v9.4,13.61 9.32,13.53 9.32,11.78 U1.H4
  Highspeed2 0.051: v6.2,18.76 6.73,19.29 TP5.TP
  LowSpeed 0.051: v6.2,18.76 6,18.56 6,15.83 6.68,15.15 9.41,15.15 9.7,14.86 9.7,13.91 v9.4,13.61
  other vias: 6.73,19.62
TMS  (via drill 0.1, 0.2)
  Highspeed1 0.051: v7.9,11.8 U1.G1
  LowSpeed 0.051: v7.9,11.8 7.1,11.8 6.53,12.38 6.53,13.55 5.8,14.28 5.8,15.3 5.17,15.93 R5.2 5.16,19.32 TP2.TP
  other vias: 5.46,19.62
VCCA  (via drill 0.1, 0.2)
  Highspeed1 0.051: U1.N2 v8.82,8.82
  Highspeed1 0.1: 11.9,14.05 11.7,14.05
  Highspeed1 0.15: 11.66,14.05 11.7,14.05 | 12,14.05 11.9,14.05
  Highspeed1 0.2: v14.23,9.26 14.23,8.37 U1.P13 v14.3,8.34 | U1.D14 14.3,13.3 | 14.3,13.3 13.85,13.75 v12.7,13.75 12,14.05 | U1.B3 9.9,13.7 10.85,13.7 11.18,14.03 11.19,14.02 11.57,14.02 11.6,14.05 11.66,14.05 | C5.1 14.3,12.89 14.3,13.3
  Highspeed2 0.2: v14.23,9.26 13.9,9.59 13.9,12.49 C5.1
  VCC 0.2: v14.23,9.26 14.23,9.13 13.2,8.1 10.3,8.1 9.58,8.82 v8.82,8.82
  LowSpeed 0.051: L1.2 v14.23,9.26 | C3.1 v8.83,8.81 v8.82,8.82
  LowSpeed 0.2: C7.1 14.27,8.37 v14.3,8.34 | C1.1 U1.B3
  other vias: 14.27,12.86 9.3,14.3
VCCIO  (via drill 0.1, 0.2)
  Highspeed1 0.2: U1.B10 U1.B9 | U1.F14 U1.G14 14.49,11.8 v14.39,11.7 | U1.L14 14.8,9.86 14.49,10.17 14.49,10.51 v14.39,10.61
  Highspeed2 0.2: v14.39,11.7 14.9,12.21 14.9,13.4 13.75,14.55 13.2,14.55 12.95,14.3 U1.B10
  VCC 0.2: U1.B5 10.55,14.55 12.55,14.55 U1.B10
  LowSpeed 0.2: v14.39,11.7 14.39,11.47 L5.2 14.39,11.57 v14.39,10.61 | C10.1 13.92,10.61 v14.39,10.61 | v14.39,10.61 14.78,10.61 C22.1 | C15.1 U1.B10 | C19.1 U1.B5
  other vias: 10.3,14.3 12.8,14.3
VCCIO2  (via drill 0.1)
  Highspeed1 0.2: U1.P11 U1.P10 v12.8,8.57 v12.81,8.58 | v11.22,8.73 10.73,8.73 U1.P5 10,8.6 9.3,8.6 9.15,8.75 9.15,9.45 v8.95,9.65 U1.L2
  LowSpeed 0.2: C9.1 8.7,9.65 v8.95,9.65 | v11.22,8.73 11.22,8.25 C21.1 11.93,8.22 11.94,8.23 12.45,8.23 v12.81,8.58 12.94,8.45 C18.1 C14.1 14.16,7.88 L4.2
VCCIOA  (via drill 0.1)
  Highspeed1 0.2: U1.F2 8.8,12.35 v8.65,12.5
  LowSpeed 0.2: L2.2 C23.1 8.43,13 C12.1 C16.1 v8.65,12.5
VCOAX
  LowSpeed 0.2: C27.1 9.7,16.67 | 9.7,16.67 9.95,16.67 | 9.95,16.67 U5.3 | 9.95,16.67 9.95,16.9 9.92,16.93 9.92,17.18 U5.4 | R48.1 9.7,16.67 | TP1.TP 10.35,19.81
  LowSpeed 0.3: U3.B1 U3.B2 U3.B3 | U3.B3 U3.A3 | U3.A3 L8.2 | U3.A3 8.48,16.67 C27.1 | TP1.TP 10.54,18.94 10.1,18.5 9.25,18.5 U3.B3
VSYNC
  Highspeed1 0.051: U7.2 5.41,14.71 6,15.3 8.8,15.3 U1.A3

### Text on the board
tPlace: 1 | 0 | G | hs-neuropix Rev. 1.2 / CERN OHL v1.2 JPN '19
bPlace: G LINK | G LINK